# Altium project Mainboard.PrjPcb (part 2 of 3)

## Sheet Power_Switch.SchDoc
size A3; PageSetup: Record=PageOptions|CenterHorizontal=True|CenterVertical=True|PrintScale=0.71|XCorrection=1.00|YCorrection=1.00|PrintKind=0|BorderSize=5000000|LeftOffset=0|BottomOffset=0|Orientation=2|PaperLength=1000|PaperWidth=1000|Scale=100|PaperSource=7|PrintQuality=-4|MediaType=1|DitherType=10|PaperKind=A4|PrintScaleMode=1; Date: 27.05.2014; DrawnBy: luths8; Organization: BFH; Address1: Bern University of Applied Sciences; Address2: Engineering and Information Technology; Address3: Jlcoweg 1; Address4: CH-3400 Burgdorf; DocumentNumber: 4; Revision: 1.0; SheetNumber: 7; SheetTotal: 19; CurrentDate: 27.05.2014
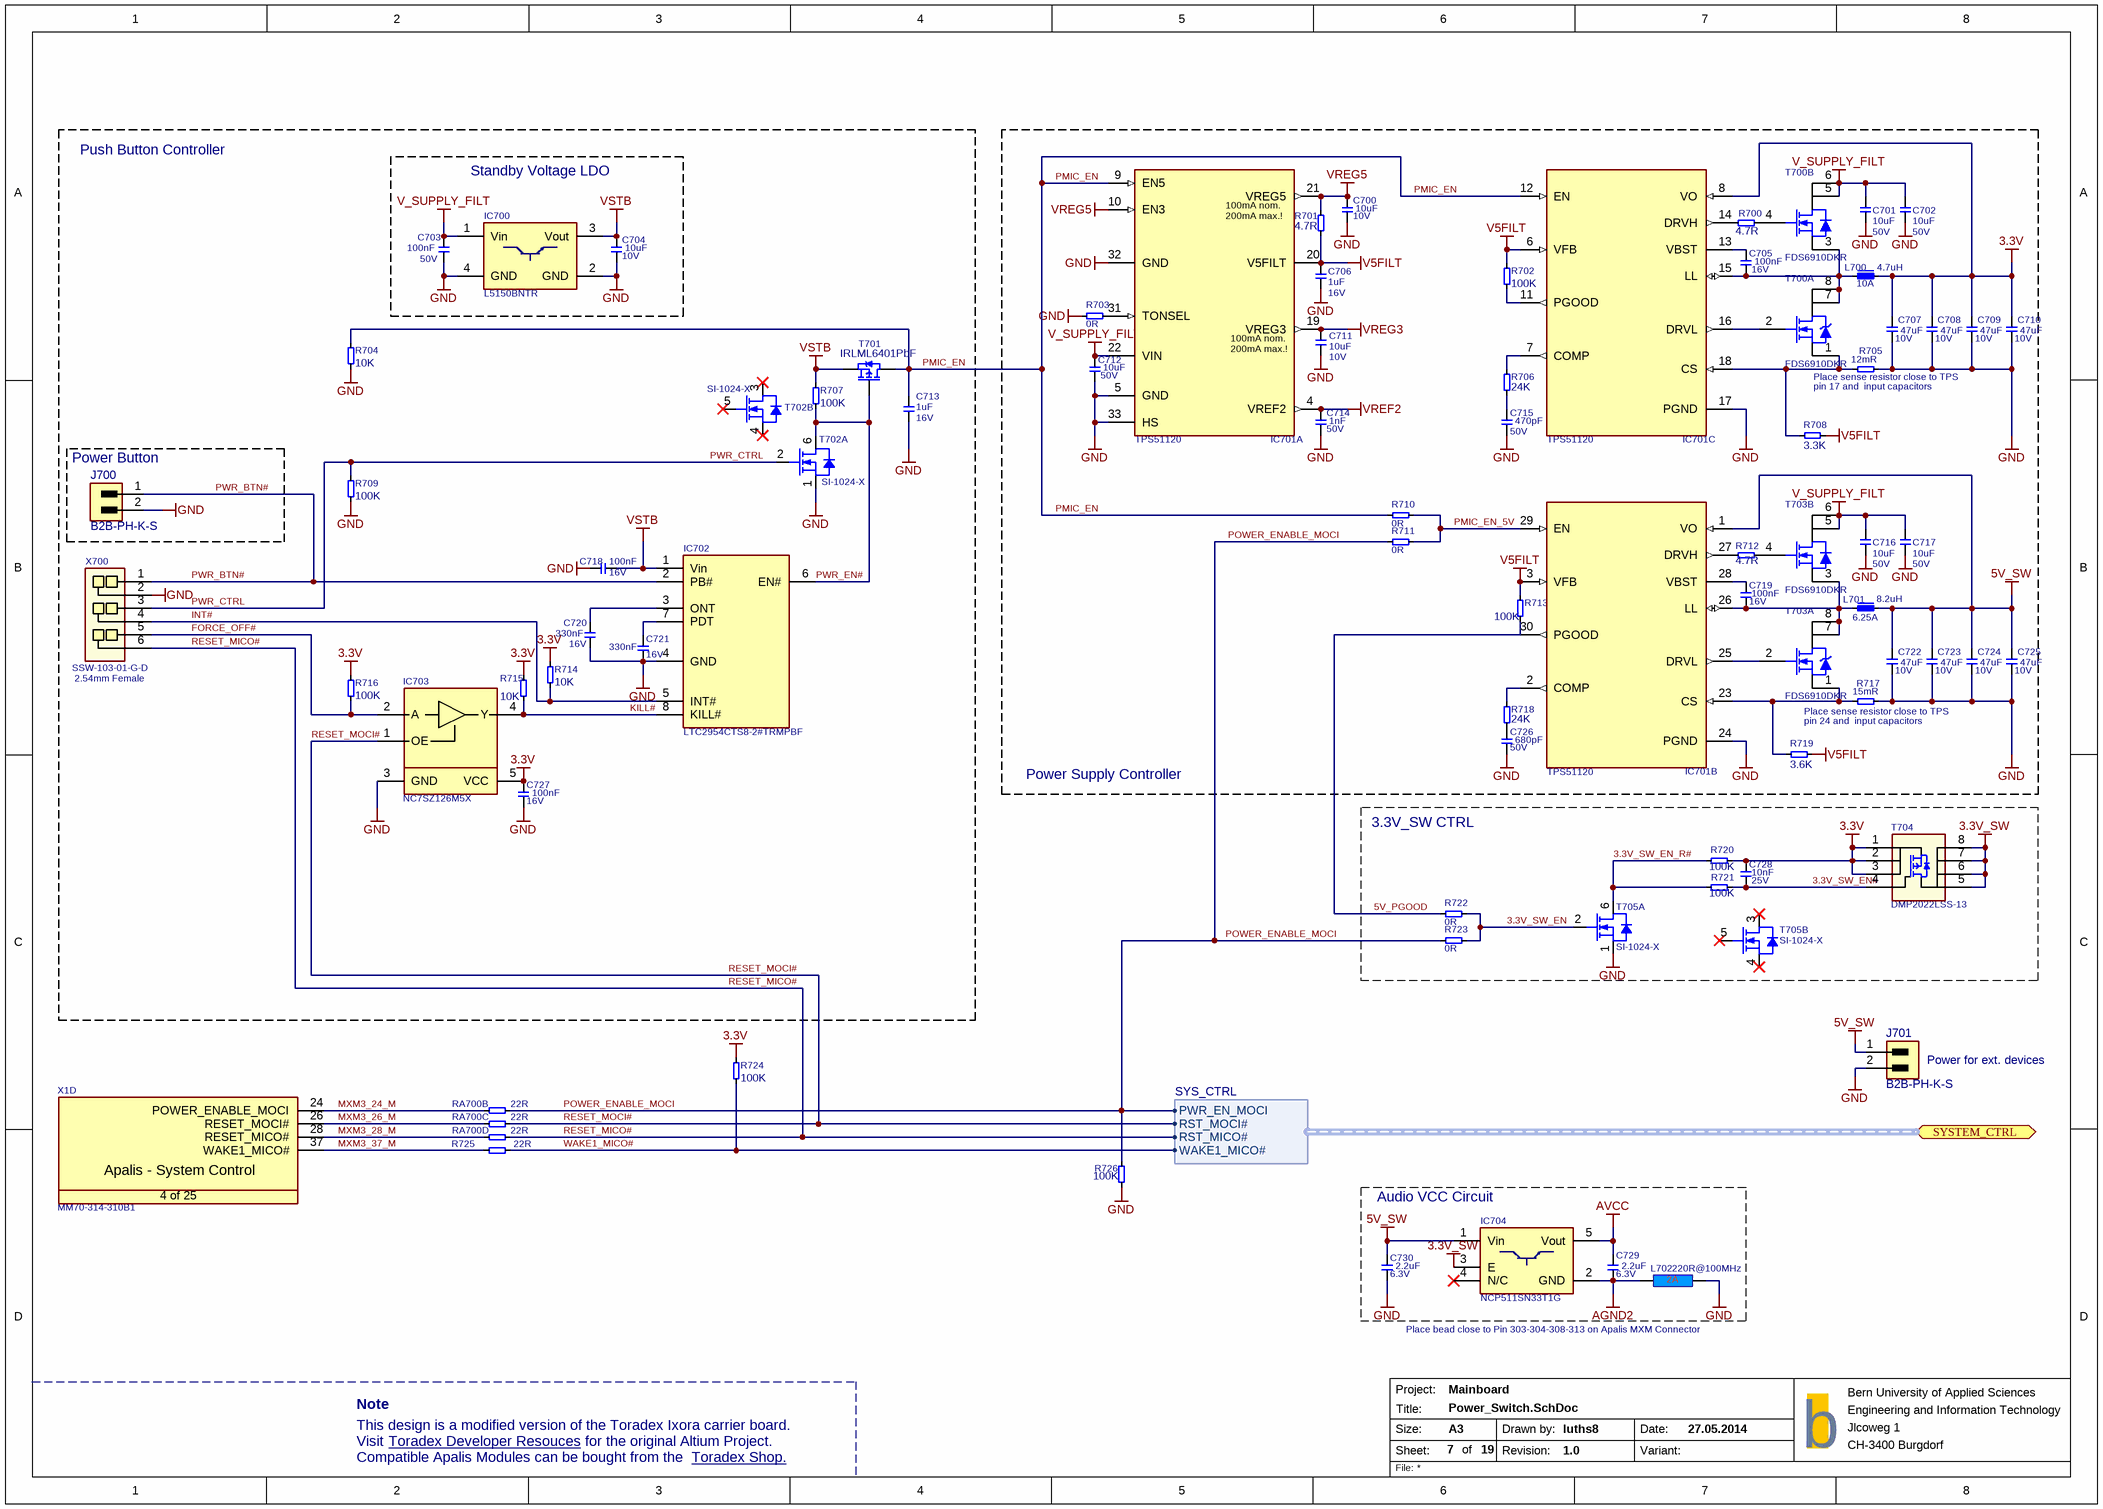
[diagram p8: Power_Switch.SchDoc]

### Parts
C700  Rating: 10V  [SMD0603CAP]  (hidden comment: 10uF)
C701  Rating: 50V  [SMD1210CAP]  (hidden comment: 10uF)
C702  Rating: 50V  [SMD1210CAP]  (hidden comment: 10uF)
C703  Rating: 50V  [SMD0603CAP]  (hidden comment: 100nF)
C704  Rating: 10V  [SMD0603CAP]  (hidden comment: 10uF)
C705  Rating: 16V  [SMD0603CAP]  (hidden comment: 100nF)
C706  Rating: 16V  [SMD0603CAP]  (hidden comment: 1uF)
C707  Rating: 10V  [SMD0805CAP]  (hidden comment: 47uF)
C708  Rating: 10V  [SMD0805CAP]  (hidden comment: 47uF)
C709  Rating: 10V  [SMD0805CAP]  (hidden comment: 47uF)
C710  Rating: 10V  [SMD0805CAP]  (hidden comment: 47uF)
C711  Rating: 10V  [SMD0603CAP]  (hidden comment: 10uF)
C712  Rating: 50V  [SMD1210CAP]  (hidden comment: 10uF)
C713  Rating: 16V  [SMD0603CAP]  (hidden comment: 1uF)
C714  Rating: 50V  [SMD0603CAP]  (hidden comment: 1nF)
C715  Rating: 50V  [SMD0603CAP]  (hidden comment: 470pF)
C716  Rating: 50V  [SMD1210CAP]  (hidden comment: 10uF)
C717  Rating: 50V  [SMD1210CAP]  (hidden comment: 10uF)
C718  Rating: 16V  [SMD0603CAP]  (hidden comment: 100nF)
C719  Rating: 16V  [SMD0603CAP]  (hidden comment: 100nF)
C720  Rating: 16V  [SMD0805CAP]  (hidden comment: 330nF)
C721  Rating: 16V  [SMD0805CAP]  (hidden comment: 330nF)
C722  Rating: 10V  [SMD0805CAP]  (hidden comment: 47uF)
C723  Rating: 10V  [SMD0805CAP]  (hidden comment: 47uF)
C724  Rating: 10V  [SMD0805CAP]  (hidden comment: 47uF)
C725  Rating: 10V  [SMD0805CAP]  (hidden comment: 47uF)
C726  Rating: 50V  [SMD0603CAP]  (hidden comment: 680pF)
C727  Rating: 16V  [SMD0603CAP]  (hidden comment: 100nF)
C728  Rating: 25V  [SMD0603CAP]  (hidden comment: 10nF)
C729  Rating: 6.3V  [SMD0603CAP]  (hidden comment: 2.2uF)
C730  Rating: 6.3V  [SMD0603CAP]  (hidden comment: 2.2uF)
IC700  L5150BNTR  [T_ON_NCV4264-2ST50T3G]
IC701  TPS51120  [QFN50P500X500X100-33N]  (parts A,B,C of 3)
IC702  LTC2954CTS8-2#TRMPBF  [T_LINEAR_LTC2954CTS8-2#PBF]
IC703  NC7SZ126M5X  [SOT95P279X142-5N]
IC704  NCP511SN33T1G  [SOT95P279X142-5N]
J700  B2B-PH-K-S  [B2B-PH-K-S]
J701  B2B-PH-K-S  [B2B-PH-K-S]
L700  Rating: 10A  [T_INDM110100]  (hidden comment: 4.7uH)
L701  Rating: 6.25A  [T_INDM120120X80N]  (hidden comment: 8.2uH)
L702  220R@100MHz  [INDC1608X95N]
R700  4.7R  [SMD0603RES]
R701  4.7R  [SMD0603RES]
R702  100K  [SMD0603RES]
R703  0R  [SMD0603RES]
R704  10K  [SMD0603RES]
R705  12mR  [SMD1206RES]
R706  24K  [SMD0603RES]
R707  100K  [SMD0603RES]
R708  3.3K  [SMD0603RES]
R709  100K  [SMD0603RES]
R710  0R  [SMD0603RES]
R711  0R  [SMD0603RES]
R712  4.7R  [SMD0603RES]
R713  100K  [SMD0603RES]
R714  10K  [SMD0603RES]
R715  10K  [SMD0603RES]
R716  100K  [SMD0603RES]
R717  15mR  [SMD1206RES]
R718  24K  [SMD0603RES]
R719  3.6K  [SMD0603RES]
R720  100K  [SMD0603RES]
R721  100K  [SMD0603RES]
R722  0R  [SMD0603RES]
R723  0R  [SMD0603RES]
R724  100K  [SMD0603RES]
R725  22R  [SMD0603RES]
R726  100K  [SMD0603RES]
RA700  22R  [T_Resistor_Array_X4]  (parts B,C,D of 4)
T700  FDS6910DKR  [SOIC127P600X173-8N]  (parts A,B of 2)
T701  IRLML6401PbF  [SOT95P237X112-3N]
T702  Manufacturer Part No.: SI-1024-X  [SOTFL50P160X60-6N]  (hidden comment: T-Vishay-SI-1024X-N)  (parts A,B of 2)
T703  FDS6910DKR  [SOIC127P600X173-8N]  (parts A,B of 2)
T704  DMP2022LSS-13  [SOIC127P600X173-8N]
T705  Manufacturer Part No.: SI-1024-X  [SOTFL50P160X60-6N]  (hidden comment: T-Vishay-SI-1024X-N)  (parts A,B of 2)
X1  Manufacturer Part No.: MM70-314-310B1  [T_JAE_MM70-314-310B1]  (hidden comment: CON-JAE-MM70-314-310B1-314-0.5mm)  (part D of 25)
X700  Manufacturer Part No.: SSW-103-01-G-D  [T_Samtec_SSW-103-01-G-D]  (hidden comment: TSW-103-01-G-D)

### Blocks framed on the sheet
Push Button Controller: C713 C718 C720 C721 C727 IC702 IC703 R704 R707 R709 R714-R716 T701 T702 X700
Standby Voltage LDO: C703 C704 IC700
Power Supply Controller: C700-C702 C705-C712 C714-C717 C719 C722-C726 IC701 L700 L701 R700-R703 R705 R706 R708 R710-R713 R717-R719 T700 T703
Power Button: J700
3.3V_SW CTRL: C728 R720-R723 T704 T705
Audio VCC Circuit: C729 C730 IC704 L702

### Ports
SYSTEM_CTRL (bidir, harness SYS_CTRL, see 12, 18, 19)

### Harnesses
SYS_CTRL: PWR_EN_MOCI, RST_MOCI#, RST_MICO#, WAKE1_MICO#

### Nets
3.3V: C707.2 C708.2 C709.2 C710.2 C727.1 C728.2 IC701.8(VO) IC703.5(VCC) L700.2 R714.1 R715.1 R716.2 R720.1 R724.2 T704.1(S) T704.2(S) T704.3(S)
3.3V_SW: IC704.3(E) T704.5(D) T704.6(D) T704.7(D) T704.8(D)
5V_SW: C722.2 C723.2 C724.2 C725.2 C730.2 IC701.1(VO) IC704.1(Vin) J701.1 L701.2
AGND2: C729.1 IC704.2(GND) L702.1
AVCC: C729.2 IC704.5(Vout)
GND: C700.1 C701.1 C702.1 C703.1 C704.1 C706.1 C707.1 C708.1 C709.1 C710.1 C711.1 C712.1 C713.1 C714.1 C715.1 C716.1 C717.1 C718.1 C720.1 C721.1 C722.1 C723.1 C724.1 C725.1 C726.1 C727.2 C730.1 IC700.2(GND) IC700.4(GND) IC701.5(GND) IC701.17(PGND) IC701.24(PGND) IC701.32(GND) IC701.33(HS) IC702.4(GND) IC703.3(GND) J700.2 J701.2 L702.2 R703.1 R704.1 R705.2 R709.1 R717.2 R726.1 T702.1(S) T705.1(S) X700.2
V5FILT: C706.2 IC701.3(VFB) IC701.6(VFB) IC701.20(V5FILT) R701.1 R702.2 R708.2 R713.2 R719.2
V_SUPPLY_FILT: C701.2 C702.2 C703.2 C712.2 C716.2 C717.2 IC700.1(Vin) IC701.22(VIN) T700.5(D) T700.6(D) T703.5(D) T703.6(D)
VREF2: C714.2 IC701.4(VREF2)
VREG3: C711.2 IC701.19(VREG3)
VREG5: C700.2 IC701.10(EN3) IC701.21(VREG5) R701.2
VSTB: C704.2 C718.2 IC700.3(Vout) IC702.1(Vin) R707.2 T701.2
3.3V_SW_EN: R722.1 R723.2 T705.2(G)
3.3V_SW_EN#: C728.1 R721.1 T704.4(G)
3.3V_SW_EN_R#: R720.2 R721.2 T705.6(D)
5V_PGOOD: IC701.30(PGOOD) R713.1 R722.2
FORCE_OFF#: IC703.2(A) R716.1 X700.5
INT#: IC702.5(INT#) R714.2 X700.4
KILL#: IC702.8(KILL#) IC703.4(Y) R715.2
MXM3_24_M: RA700.2 X1.24(POWER_ENABLE_MOCI)
MXM3_26_M: RA700.3 X1.26(RESET_MOCI#)
MXM3_28_M: RA700.4 X1.28(RESET_MICO#)
MXM3_37_M: R725.1 X1.37(WAKE1_MICO#)
PMIC_EN: C713.2 IC701.9(EN5) IC701.12(EN) R704.2 R710.1 T701.3
PMIC_EN_5V: IC701.29(EN) R710.2 R711.2
POWER_ENABLE_MOCI: R711.1 R723.1 R726.2 RA700.6 ; port SYSTEM_CTRL.PWR_EN_MOCI
PWR_BTN#: IC702.2(PB#) J700.1 X700.1
PWR_CTRL: R709.2 T702.2(G) X700.3
PWR_EN#: IC702.6(EN#) R707.1 T701.1 T702.6(D)
RESET_MICO#: RA700.8 X700.6 ; port SYSTEM_CTRL.RST_MICO#
RESET_MOCI#: IC703.1(OE) RA700.7 ; port SYSTEM_CTRL.RST_MOCI#
WAKE1_MICO#: R724.1 R725.2 ; port SYSTEM_CTRL.WAKE1_MICO#
NetC705_1: C705.1 IC701.15(LL) L700.1 T700.3(S) T700.7(D) T700.8(D)
NetC705_2: C705.2 IC701.13(VBST)
NetC715_2: C715.2 R706.1
NetC719_1: C719.1 IC701.26(LL) L701.1 T703.3(S) T703.7(D) T703.8(D)
NetC719_2: C719.2 IC701.28(VBST)
NetC720_2: C720.2 IC702.3(ONT)
NetC721_2: C721.2 IC702.7(PDT)
NetC726_2: C726.2 R718.1
NetIC701_2: IC701.2(COMP) R718.2
NetIC701_7: IC701.7(COMP) R706.2
NetIC701_11: IC701.11(PGOOD) R702.1
NetIC701_14: IC701.14(DRVH) R700.1
NetIC701_16: IC701.16(DRVL) T700.2(G)
NetIC701_18: IC701.18(CS) R705.1 R708.1 T700.1(S)
NetIC701_23: IC701.23(CS) R717.1 R719.1 T703.1(S)
NetIC701_25: IC701.25(DRVL) T703.2(G)
NetIC701_27: IC701.27(DRVH) R712.1
NetIC701_31: IC701.31(TONSEL) R703.2
NetR700_2: R700.2 T700.4(G)
NetR712_2: R712.2 T703.4(G)

Not connected (* = marked no-connect by the designer): IC704 4(N/C)*; T702 3(D)* 4(S)* 5(G)*; T705 3(D)* 4(S)* 5(G)*

### Notes on the sheet
- (near R705) Place sense resistor close to TPS
- (near R705) pin 17 and  input capacitors
- (near X700) 2.54mm Female
- (near R717) Place sense resistor close to TPS
- pin 24 and  input capacitors
- (near J701) Power for ext. devices
- Place bead close to Pin 303-304-308-313 on Apalis MXM Connector
- Note
- This design is a modified version of the Toradex Ixora carrier board.
- Visit
- Compatible Apalis Modules can be bought from the
- Toradex Developer Resouces <https://developer.toradex.com/products/ixora-carrier-board>
- for the original Altium Project.
- Toradex Shop. <https://www.toradex.com/order-now/apalis-arm-family>
- Project:
- Size:
- Sheet:
- Title:
- A3
- of
- Drawn by:
- Revision:
- Date:
- Variant:
- b
- File:
- (in symbol CON-JAE-MM70-314-310B1-314-0.5mm, part D) Apalis - System Control; 4 of 25
- (in symbol IC-TI-TPS51120, part A) 100mA nom.; 200mA max.!

### Library data of the parts
C700 C704 C711 = C-X5R-10uF-10V-20%-0603: Capacitor Ceramic X5R 10uF 10V 20% 0603; Tolerance: 20%; Type: X5R; Value: 10uF
C701 C702 C712 C716 C717 = C-X5R-10uF-50V-20%-1210: Capacitor Ceramic X5R 10uF 50V 20% 1210; Tolerance: 20%; Type: X5R; Value: 10uF
C703 = C-X7R-100nF-50V-20%-0603: Capacitor Ceramic X7R 100nF 50V 20% 0603; Tolerance: 20%; Type: X7R; Value: 100nF
C705 C718 C719 C727 = C-X7R-100nF-16V-10%-0402: Capacitor Ceramic X7R 100nF 16V 10% 0603; Tolerance: 10%; Type: X7R; Value: 100nF
C706 C713 = C-X5R-1uF-16V-20%-0603: Capacitor Ceramic X5R 1uF 16V 20% 0603; Tolerance: 20%; Type: X5R; Value: 1uF
C707-C710 C722-C725 = C-X5R-47uF-10V-20%-0805: Capacitor Ceramic X5R 47uF 10V 20% 0805; Tolerance: 20%; Type: X5R; Value: 47uF
C714 = C-X7R-1nF-50V-10%-0402: Capacitor Ceramic X7R 1nF 50V 10% 0603; Tolerance: 10%; Type: X7R; Value: 1nF
C715 = C-X7R-470pF-50V-10%-0402: Capacitor Ceramic X7R 470pF 50V 10% 0603; Tolerance: 10%; Type: X7R; Value: 470pF
C720 C721 = C-X7R-330nF-16V-10%-0805: Capacitor Ceramic X7R 330nF 16V 10% 0805; Tolerance: 10%; Type: X7R; Value: 330nF
C726 = C-X7R-680pF-50V-10%-0402: Capacitor Ceramic X7R 680pF 50V 10% 0603; Tolerance: 10%; Type: X7R; Value: 680pF
C728 = C-X7R-10nF-25V-10%-0402: Capacitor Ceramic X7R 10nF 25V 10% 0603; Tolerance: 10%; Type: X7R; Value: 10nF
C729 C730 = C-X5R-2.2uF-6.3V-20%-0603: Capacitor Ceramic X5R 2.2uF 6.3V 20% 0603; Tolerance: 20%; Type: X5R; Value: 2.2uF
IC700 = IC-ON-NCV4264-2ST50T3G: L5150BNTR LDO Regulator; Manufacturer Name: STMicroelectronics; Manufacturer Part No.: L5150BNTR
IC701 = IC-TI-TPS51120: Power Supply Controller; Manufacturer Name: Texas Instruments; Manufacturer Part No.: TPS51120
IC702 = IC-LIN-LTC2954CTS8-2#PBF: Push Button On/Off Controller; Manufacturer Name: Linear; Manufacturer Part No.: LTC2954CTS8-2#TRMPBF
IC703 = IC-FAR-NC7SZ126M5X: NC7SZ126M5X  Buffer Three-State Output; Manufacturer Name: Fairchild Semiconductor; Manufacturer Part No.: NC7SZ126M5X
IC704 = IC-ON-NCP511SN33T1G: NCP511SN33T1G LDO Regulator; Manufacturer Name: ON Semiconductor; Manufacturer Part No.: NCP511SN33T1G
J700 J701 = Connector 2x1P: Manufacturer Part No.: B2B-PH-K-S
L700 = L-Bourns-SRP1038A-4R7M: Inductor 4.7uH 10A 20% 15.5 mOhm -40°C to125°C; Manufacturer Name: Bourns; Tolerance: 20%; Manufacturer Part No.: SRP1038A-4R7M; Value: 4.7uH; DC Resistance: 15.5 mOhm
L701 = L-Wurth-744771008-8.2uH-6.25A-20%: Inductance 8.2uH 6.25A 20%; Manufacturer Name: Wurth; Tolerance: 20%; Manufacturer Part No.: 744771008; Value: 8.2uH
L702 = L-220R@100MHz-2A-25%-0603: 220R@100MHz 2A EMI FILTER; Tolerance: 25%; Rating: 2A; Value: 220R@100MHz
R700 R701 R712 = R-4.7R-63mW-5%-0402: Resistor 4.7 ohm 63mW 5% 0603; Rating: 63mW; Tolerance: 5%; Value: 4.7R
R702 R707 R709 R713 R716 R720 R721 R724 R726 = R-100KR-63mW-5%-0402: Resistor 100 Kohm 63mW 5% 0603; Value: 100KR; Rating: 63mW; Tolerance: 5%
R703 = R-0R-63mW-1%-0402: Resistor 0 ohm 63mW 1% 0603; Rating: 63mW; Tolerance: 1%; Value: 0R
R704 R714 R715 = R-10KR-63mW-5%-0402: Resistor 10 Kohm 63mW 5% 0603; Value: 10KR; Rating: 63mW; Tolerance: 5%
R705 = R-12mR-250mW-1%-1206: Resistor 12 mohm 250mW 1% 1206; Rating: 250mW; Tolerance: 1%; Value: 12mR
R706 R718 = R-24KR-63mW-1%-0402: Resistor 24 Kohm 63mW 1% 0603; Value: 24KR; Rating: 63mW; Tolerance: 1%
R708 = R-3.3KR-63mW-1%-0402: Resistor 3.3 Kohm 63mW 1% 0603; Value: 3.3KR; Rating: 63mW; Tolerance: 1%
R710 R711 R722 R723 = R-0R-63mW-1%-0603: Resistor 0 ohm 63mW 1% 0603; Rating: 63mW; Tolerance: 1%; Value: 0R
R717 = R-15mR-250mW-1%-1206: Resistor 15 mohm 250mW 1% 1206; Rating: 250mW; Tolerance: 1%; Value: 15mR
R719 = R-3.6KR-63mW-1%-0402: Resistor 3.6 Kohm 63mW 1% 0603; Value: 3.6KR; Rating: 63mW; Tolerance: 1%
R725 = R-22R-63mW-5%-0402: Resistor 22 ohm 63mW 5% 0603; Rating: 63mW; Tolerance: 5%; Value: 22R
RA700 = RA-22R-63mW-5%-1206-div: Resistor Array 22 R 63mW 5% 1206; Tolerance: 5%; Power Dissipation: 63mW; Value: 22R
T700 T703 = T-Fairchild-FDS6982AS-N: N-Channel PowerTrench SyncFET; Manufacturer Name: Fairchild; Manufacturer Part No.: FDS6910DKR
T701 = T-IR-IRLML6401PbF-SOT-23: p-channel MOSFET, IRLML6401PbF; Manufacturer Name: International Rectifier; Manufacturer Part No.: IRLML6401PbF
T702 T705 = T-Vishay-SI-1024X-N: Dual N-Channel 20V (D-S)  MOSFET; Manufacturer Name: Vishay
T704 = T-Diodes-DMP2022LSS-13-8-SOIC: p-channel MOSFET, DMP2022LSS-13; Manufacturer Name: DIODES; Manufacturer Part No.: DMP2022LSS-13
X1 = CON-JAE-MM70-314-310B1-314-0.5mm: MXM3 Connector; Manufacturer Name: JAE; No. of ways: 314
X700 = CON-Samtec-SSW-103-01-G-D: Receptacle Female Socket, 2x3 Pins, 2.54mm pitch; Manufacturer Name: Samtec; No. of ways: 2x3; Pitch: 2.54mm

## Sheet RGB_Display.SchDoc
size A3; PageSetup: Record=PageOptions|CenterHorizontal=True|CenterVertical=True|PrintScale=0.73|XCorrection=1.00|YCorrection=1.00|PrintKind=0|BorderSize=5000000|LeftOffset=0|BottomOffset=0|Orientation=2|PaperLength=1000|PaperWidth=1000|Scale=100|PaperSource=7|PrintQuality=-4|MediaType=1|DitherType=10|PaperKind=A4|PrintScaleMode=1; Date: 27.05.2014; DrawnBy: luths8; Organization: BFH; Address1: Bern University of Applied Sciences; Address2: Engineering and Information Technology; Address3: Jlcoweg 1; Address4: CH-3400 Burgdorf; DocumentNumber: 9; Revision: 1.0; SheetNumber: 13; SheetTotal: 19; CurrentDate: 27.05.2014
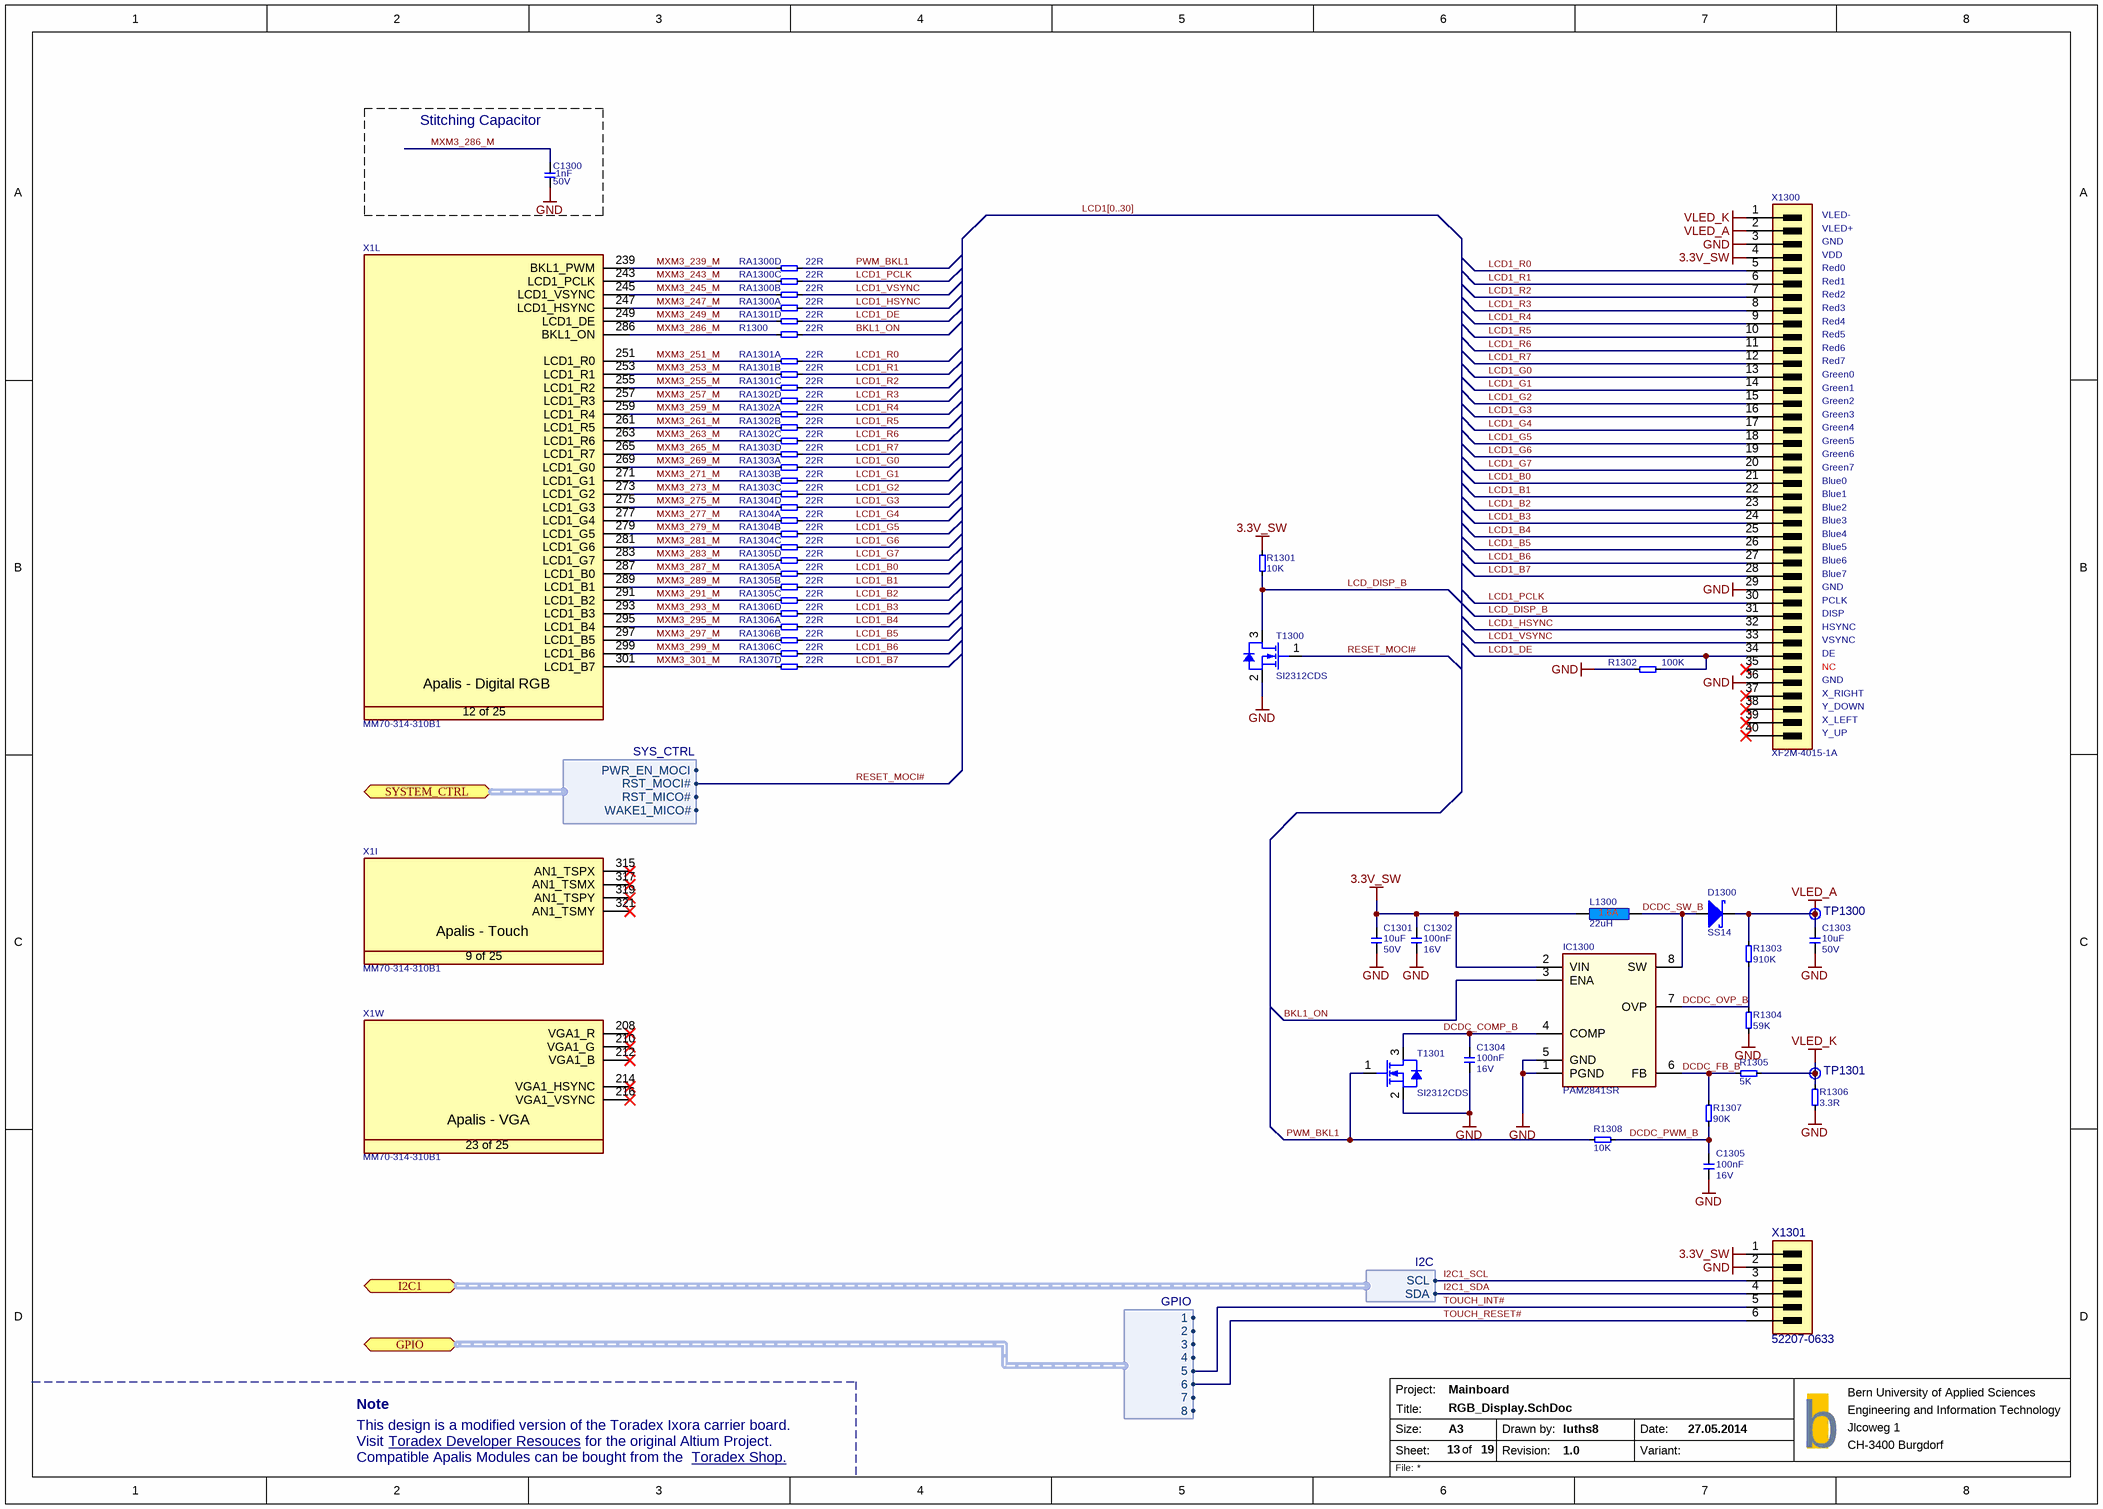
[diagram p9: RGB_Display.SchDoc]

### Parts
C1300  Rating: 50V  [SMD0603CAP]  (hidden comment: 1nF)
C1301  Rating: 50V  [SMD1210CAP]  (hidden comment: 10uF)
C1302  Rating: 16V  [SMD0603CAP]  (hidden comment: 100nF)
C1303  Rating: 50V  [SMD1210CAP]  (hidden comment: 10uF)
C1304  value 100nF  Rating: 16V  [SMD0603CAP]  (hidden comment: 100nF 16V)
C1305  value 100nF  Rating: 16V  [SMD0603CAP]  (hidden comment: 100nF 16V)
D1300  SS14  [T_DO-214-AC]
IC1300  PAM2841SR  [T_TSOP65P490X110-8N]
L1300  22uH  [T_INDM5050]
R1300  22R  [SMD0603RES]
R1301  10K  [SMD0603RES]
R1302  100K  [SMD0603RES]
R1303  910K  [SMD0603RES]
R1304  59K  [SMD0603RES]
R1305  5K  [SMD0603RES]
R1306  3.3R  [SMD0603RES]
R1307  90K  [SMD0603RES]
R1308  10K  [SMD0603RES]
RA1300  22R  [T_Resistor_Array_X4]  (parts A,B,C,D of 4)
RA1301  22R  [T_Resistor_Array_X4]  (parts A,B,C,D of 4)
RA1302  22R  [T_Resistor_Array_X4]  (parts A,B,C,D of 4)
RA1303  22R  [T_Resistor_Array_X4]  (parts A,B,C,D of 4)
RA1304  22R  [T_Resistor_Array_X4]  (parts A,B,C,D of 4)
RA1305  22R  [T_Resistor_Array_X4]  (parts A,B,C,D of 4)
RA1306  22R  [T_Resistor_Array_X4]  (parts A,B,C,D of 4)
RA1307  22R  [T_Resistor_Array_X4]  (part D of 4)
T1300  SI2312CDS  [T_SOT95P230X110-3N]
T1301  SI2312CDS  [T_SOT95P230X110-3N]
TP1300  Testpoint  [TP]  (value not drawn)  (no BOM)
TP1301  Testpoint  [TP]  (value not drawn)  (no BOM)
X1  Manufacturer Part No.: MM70-314-310B1  [T_JAE_MM70-314-310B1]  (hidden comment: CON-JAE-MM70-314-310B1-314-0.5mm)  (parts I,L,W of 25)
X1300  XF2M-4015-1A  [T_Omron_XF2M-4015-1A-MIRROR]
X1301  52207-0633  [T_MOLEX_52207-0633]

### Blocks framed on the sheet
Stitching Capacitor: C1300

### Ports
GPIO (bidir, harness GPIO, see 11, 19, 4), I2C1 (bidir, harness I2C, see 17, 18, 19, 5), SYSTEM_CTRL (bidir, harness SYS_CTRL, see 18, 19, 4)

### Harnesses
I2C: SCL, SDA
SYS_CTRL: PWR_EN_MOCI, RST_MOCI#, RST_MICO#, WAKE1_MICO#
GPIO: 1, 2, 3, 4, 5, 6, 7, 8

### Nets
3.3V_SW: C1301.2 C1302.1 IC1300.2(VIN) L1300.1 R1301.2 X1300.4(VCC) X1301.1
GND: C1300.1 C1301.1 C1302.2 C1303.1 C1304.1 C1305.1 IC1300.1(PGND) IC1300.5(GND) R1302.1 R1304.1 R1306.1 T1300.2(S) T1301.2(S) X1300.3(VCC) X1300.29(VSS) X1300.36(VDD) X1301.2
VLED_A: C1303.2 D1300.1 R1303.2 TP1300.1 X1300.2(VSS)
VLED_K: R1305.2 R1306.2 TP1301.1 X1300.1(VSS)
BKL1_ON: IC1300.3(ENA) R1300.2
DCDC_COMP_B: C1304.2 IC1300.4(COMP) T1301.3(D)
DCDC_FB_B: IC1300.6(FB) R1305.1 R1307.2
DCDC_OVP_B: IC1300.7(OVP) R1303.1 R1304.2
DCDC_PWM_B: C1305.2 R1307.1 R1308.2
DCDC_SW_B: D1300.2 IC1300.8(SW) L1300.2
I2C1_SCL: X1301.3 ; port I2C1.SCL
I2C1_SDA: X1301.4 ; port I2C1.SDA
LCD1_B0: RA1305.7 X1300.21(VSS)
LCD1_B1: RA1305.6 X1300.22(R5)
LCD1_B2: RA1305.5 X1300.23(R4)
LCD1_B3: RA1306.8 X1300.24(R3)
LCD1_B4: RA1306.7 X1300.25(R2)
LCD1_B5: RA1306.6 X1300.26(R1)
LCD1_B6: RA1306.5 X1300.27(R0)
LCD1_B7: RA1307.8 X1300.28(DCLK)
LCD1_DE: R1302.2 RA1301.8 X1300.34(SHUT)
LCD1_G0: RA1303.7 X1300.13(B0)
LCD1_G1: RA1303.6 X1300.14(VSS)
LCD1_G2: RA1303.5 X1300.15(G5)
LCD1_G3: RA1304.8 X1300.16(G4)
LCD1_G4: RA1304.7 X1300.17(G3)
LCD1_G5: RA1304.6 X1300.18(G2)
LCD1_G6: RA1304.5 X1300.19(G1)
LCD1_G7: RA1305.8 X1300.20(G0)
LCD1_HSYNC: RA1300.5 X1300.32(ENB)
LCD1_PCLK: RA1300.7 X1300.30(HSYNC)
LCD1_R0: RA1301.7 X1300.5(PWCTRL)
LCD1_R1: RA1301.6 X1300.6(LEDCTRL)
LCD1_R2: RA1301.5 X1300.7(RESET#)
LCD1_R3: RA1302.8 X1300.8(B5)
LCD1_R4: RA1302.7 X1300.9(B4)
LCD1_R5: RA1302.6 X1300.10(B3)
LCD1_R6: RA1302.5 X1300.11(B2)
LCD1_R7: RA1303.8 X1300.12(B1)
LCD1_VSYNC: RA1300.6 X1300.33(NC)
LCD_DISP_B: R1301.1 T1300.3(D) X1300.31(VSYNC)
MXM3_239_M: RA1300.4 X1.239(BKL1_PWM)
MXM3_243_M: RA1300.3 X1.243(LCD1_PCLK)
MXM3_245_M: RA1300.2 X1.245(LCD1_VSYNC)
MXM3_247_M: RA1300.1 X1.247(LCD1_HSYNC)
MXM3_249_M: RA1301.4 X1.249(LCD1_DE)
MXM3_251_M: RA1301.3 X1.251(LCD1_R0)
MXM3_253_M: RA1301.2 X1.253(LCD1_R1)
MXM3_255_M: RA1301.1 X1.255(LCD1_R2)
MXM3_257_M: RA1302.4 X1.257(LCD1_R3)
MXM3_259_M: RA1302.3 X1.259(LCD1_R4)
MXM3_261_M: RA1302.2 X1.261(LCD1_R5)
MXM3_263_M: RA1302.1 X1.263(LCD1_R6)
MXM3_265_M: RA1303.4 X1.265(LCD1_R7)
MXM3_269_M: RA1303.3 X1.269(LCD1_G0)
MXM3_271_M: RA1303.2 X1.271(LCD1_G1)
MXM3_273_M: RA1303.1 X1.273(LCD1_G2)
MXM3_275_M: RA1304.4 X1.275(LCD1_G3)
MXM3_277_M: RA1304.3 X1.277(LCD1_G4)
MXM3_279_M: RA1304.2 X1.279(LCD1_G5)
MXM3_281_M: RA1304.1 X1.281(LCD1_G6)
MXM3_283_M: RA1305.4 X1.283(LCD1_G7)
MXM3_286_M: C1300.2 R1300.1 X1.286(BKL1_ON)
MXM3_287_M: RA1305.3 X1.287(LCD1_B0)
MXM3_289_M: RA1305.2 X1.289(LCD1_B1)
MXM3_291_M: RA1305.1 X1.291(LCD1_B2)
MXM3_293_M: RA1306.4 X1.293(LCD1_B3)
MXM3_295_M: RA1306.3 X1.295(LCD1_B4)
MXM3_297_M: RA1306.2 X1.297(LCD1_B5)
MXM3_299_M: RA1306.1 X1.299(LCD1_B6)
MXM3_301_M: RA1307.4 X1.301(LCD1_B7)
PWM_BKL1: R1308.1 RA1300.8 T1301.1(G)
RESET_MOCI#: T1300.1(G) ; port SYSTEM_CTRL.RST_MOCI#
TOUCH_INT#: X1301.5 ; port GPIO.5
TOUCH_RESET#: X1301.6 ; port GPIO.6

Not connected (* = marked no-connect by the designer): X1 208(VGA1_R)* 210(VGA1_G)* 212(VGA1_B)* 214(VGA1_HSYNC)* 216(VGA1_VSYNC)* 315(AN1_TSPX)* 317(AN1_TSMX)* 319(AN1_TSPY)* 321(AN1_TSMY)*; X1300 35(VSS)* 37(YU)* 38(XR)* 39(YD)* 40(XL)*

### Buses and harness runs
bus LCD1[0..30]

### Notes on the sheet
- (near X1300) VLED-
- (near X1300) VLED+
- (near X1300) GND
- (near X1300) Red0
- (near X1300) Red1
- (near X1300) Red2
- (near X1300) Red3
- (near X1300) VDD
- (near X1300) Green0
- (near X1300) Red4
- (near X1300) Red5
- (near X1300) Red6
- (near X1300) Red7
- (near X1300) Green1
- (near X1300) Green2
- (near X1300) Green3
- (near X1300) Green4
- (near X1300) Green5
- (near X1300) Blue0
- (near X1300) Blue1
- (near X1300) Blue2
- (near X1300) Green6
- (near X1300) Green7
- (near X1300) Blue3
- (near X1300) Blue4
- (near X1300) Blue5
- (near X1300) Blue6
- (near X1300) Blue7
- (near X1300) PCLK
- (near X1300) DISP
- (near X1300) HSYNC
- (near X1300) VSYNC
- (near X1300) DE
- (near X1300) NC
- (near X1300) X_RIGHT
- (near X1300) Y_DOWN
- (near X1300) X_LEFT
- (near X1300) Y_UP
- Note
- This design is a modified version of the Toradex Ixora carrier board.
- Visit
- Compatible Apalis Modules can be bought from the
- Toradex Developer Resouces <https://developer.toradex.com/products/ixora-carrier-board>
- for the original Altium Project.
- Toradex Shop. <https://www.toradex.com/order-now/apalis-arm-family>
- Project:
- Size:
- Sheet:
- Title:
- A3
- of
- Drawn by:
- Revision:
- Date:
- Variant:
- b
- File:
- (in symbol CON-JAE-MM70-314-310B1-314-0.5mm, part I) Apalis - Touch; 9 of 25
- (in symbol CON-JAE-MM70-314-310B1-314-0.5mm, part L) Apalis - Digital RGB; 12 of 25
- (in symbol CON-JAE-MM70-314-310B1-314-0.5mm, part W) Apalis - VGA; 23 of 25

### Library data of the parts
C1300 = C-X7R-1nF-50V-10%-0402: Capacitor Ceramic X7R 1nF 50V 10% 0603; Tolerance: 10%; Type: X7R; Value: 1nF
C1301 C1303 = C-X5R-10uF-50V-10%-1210: Capacitor Ceramic X5R 10uF 50V 10% 1210; Manufacturer: Generic; Tolerance: 10%; Type: X5R; Manufacturer Part Number: *; Value: 10uF
C1302 = C-X7R-100nF-16V-10%-0603: Capacitor Ceramic X7R 100nF 16V 10% 0603; Manufacturer: Generic; Tolerance: 10%; Type: X7R; Manufacturer Part Number: *; Value: 100nF
C1304 C1305 = C-X7R-100nF-16V-10%-0603: Capacitor Ceramic X7R 100nF 16V 10% 0603; Tolerance: 10%; Type: X7R
D1300 = D-Fairchild-SS14: Schottky Diode 40V 1A; Manufacturer Name: Fairdhild; Manufacturer Part No.: SS14
IC1300 = IC-DiodesInc-PAM2841GR: Diodes Inc, PAM2841GR, DC/DC step-up LED driver; Manufacturer: Diodes Incorporated; Manufacturer Part No.: PAM2841GR; Package: DFN2x2-8
L1300 = L-Bourns-SRN5040-220M: Inductor shielded 22uH 1.6A; Manufacturer: Generic; Tolerance: 25%; Rating: 1.6A; Manufacturer Part Number: *; Value: 22uH
R1300 = R-22R-63mW-5%-0402: Resistor 22 ohm 63mW 5% 0603; Rating: 63mW; Tolerance: 5%; Value: 22R
R1301 R1308 = R-10KR-63mW-1%-0603: Resistor 10 Kohm 63mW 1% 0603; Manufacturer: Generic; Rating: 63mW; Tolerance: 1%; Value: 10K; Manufacturer Part Number: *
R1302 = R-100KR-63mW-5%-0603: Resistor 100 Kohm 63mW 5% 0603; Manufacturer: Generic; Value: 100KR; Rating: 63mW; Tolerance: 5%; Manufacturer Part Number: *
R1303 = R-910KR-63mW-1%-0603: Resistor 910 Kohm 63mW 1% 0603; Manufacturer: Generic; Value: 910KR; Rating: 63mW; Tolerance: 1%; Manufacturer Part Number: *
R1304 = R-59KR-63mW-1%-0603: Resistor 59 Kohm 63mW 1% 0603; Manufacturer: Generic; Value: 49KR; Rating: 63mW; Tolerance: 1%; Manufacturer Part Number: *
R1305 = R-5KR-63mW-1%-0603: Resistor 5 Kohm 63mW 1% 0603; Manufacturer: Generic; Rating: 63mW; Tolerance: 1%; Value: 5K; Manufacturer Part Number: *
R1306 = R-3.3R-63mW-1%-0603: Resistor 3.3 ohm 63mW 1% 0603; Manufacturer: Generic; Rating: 63mW; Tolerance: 1%; Manufacturer Part Number: *; Value: 3.3R
R1307 = R-90KR-63mW-1%-0603: Resistor 90 Kohm 63mW 1% 0603; Manufacturer: Generic; Rating: 63mW; Tolerance: 1%; Value: 90K; Manufacturer Part Number: *
RA1300-RA1307 = RA-22R-63mW-5%-1206-div: Resistor Array 22 R 63mW 5% 1206; Tolerance: 5%; Power Dissipation: 63mW; Value: 22R
T1300 T1301 = T-Vishay-SI2312CDS: N-Channel 20V (D-S)  MOSFET; Manufacturer: Vishay; Manufacturer Part No.: SI2312CDS
X1 = CON-JAE-MM70-314-310B1-314-0.5mm: as X1 on sheet Power_Switch
X1300 = CON-Omron-XF2M-4015-1A-40-0.5mm: RGB Connector; Manufacturer Name: Omron; No. of ways: 40; Pitch: 0.5mm; Manufacturer Part No.: XF2M-4015-1A; System: Connector
X1301 = CON-Molex-52207-0633: 1mm Pitch FFC/FPC Connector; Manufacturer Name: Molex; No. of ways: 8; Pitch: 0.5mm; Manufacturer Part No.: 52207-0633; System: Connector

## Sheet RTC.SchDoc
size A3; PageSetup: Record=PageOptions|CenterHorizontal=True|CenterVertical=True|PrintScale=0.73|XCorrection=1.00|YCorrection=1.00|PrintKind=0|BorderSize=5000000|LeftOffset=0|BottomOffset=0|Orientation=2|PaperLength=1000|PaperWidth=1000|Scale=100|PaperSource=7|PrintQuality=-4|MediaType=1|DitherType=10|PaperKind=A4|PrintScaleMode=1; Date: 27.05.2014; DrawnBy: luths8; Organization: BFH; Address1: Bern University of Applied Sciences; Address2: Engineering and Information Technology; Address3: Jlcoweg 1; Address4: CH-3400 Burgdorf; DocumentNumber: 5; Revision: 1.0; SheetNumber: 8; SheetTotal: 19; CurrentDate: 27.05.2014
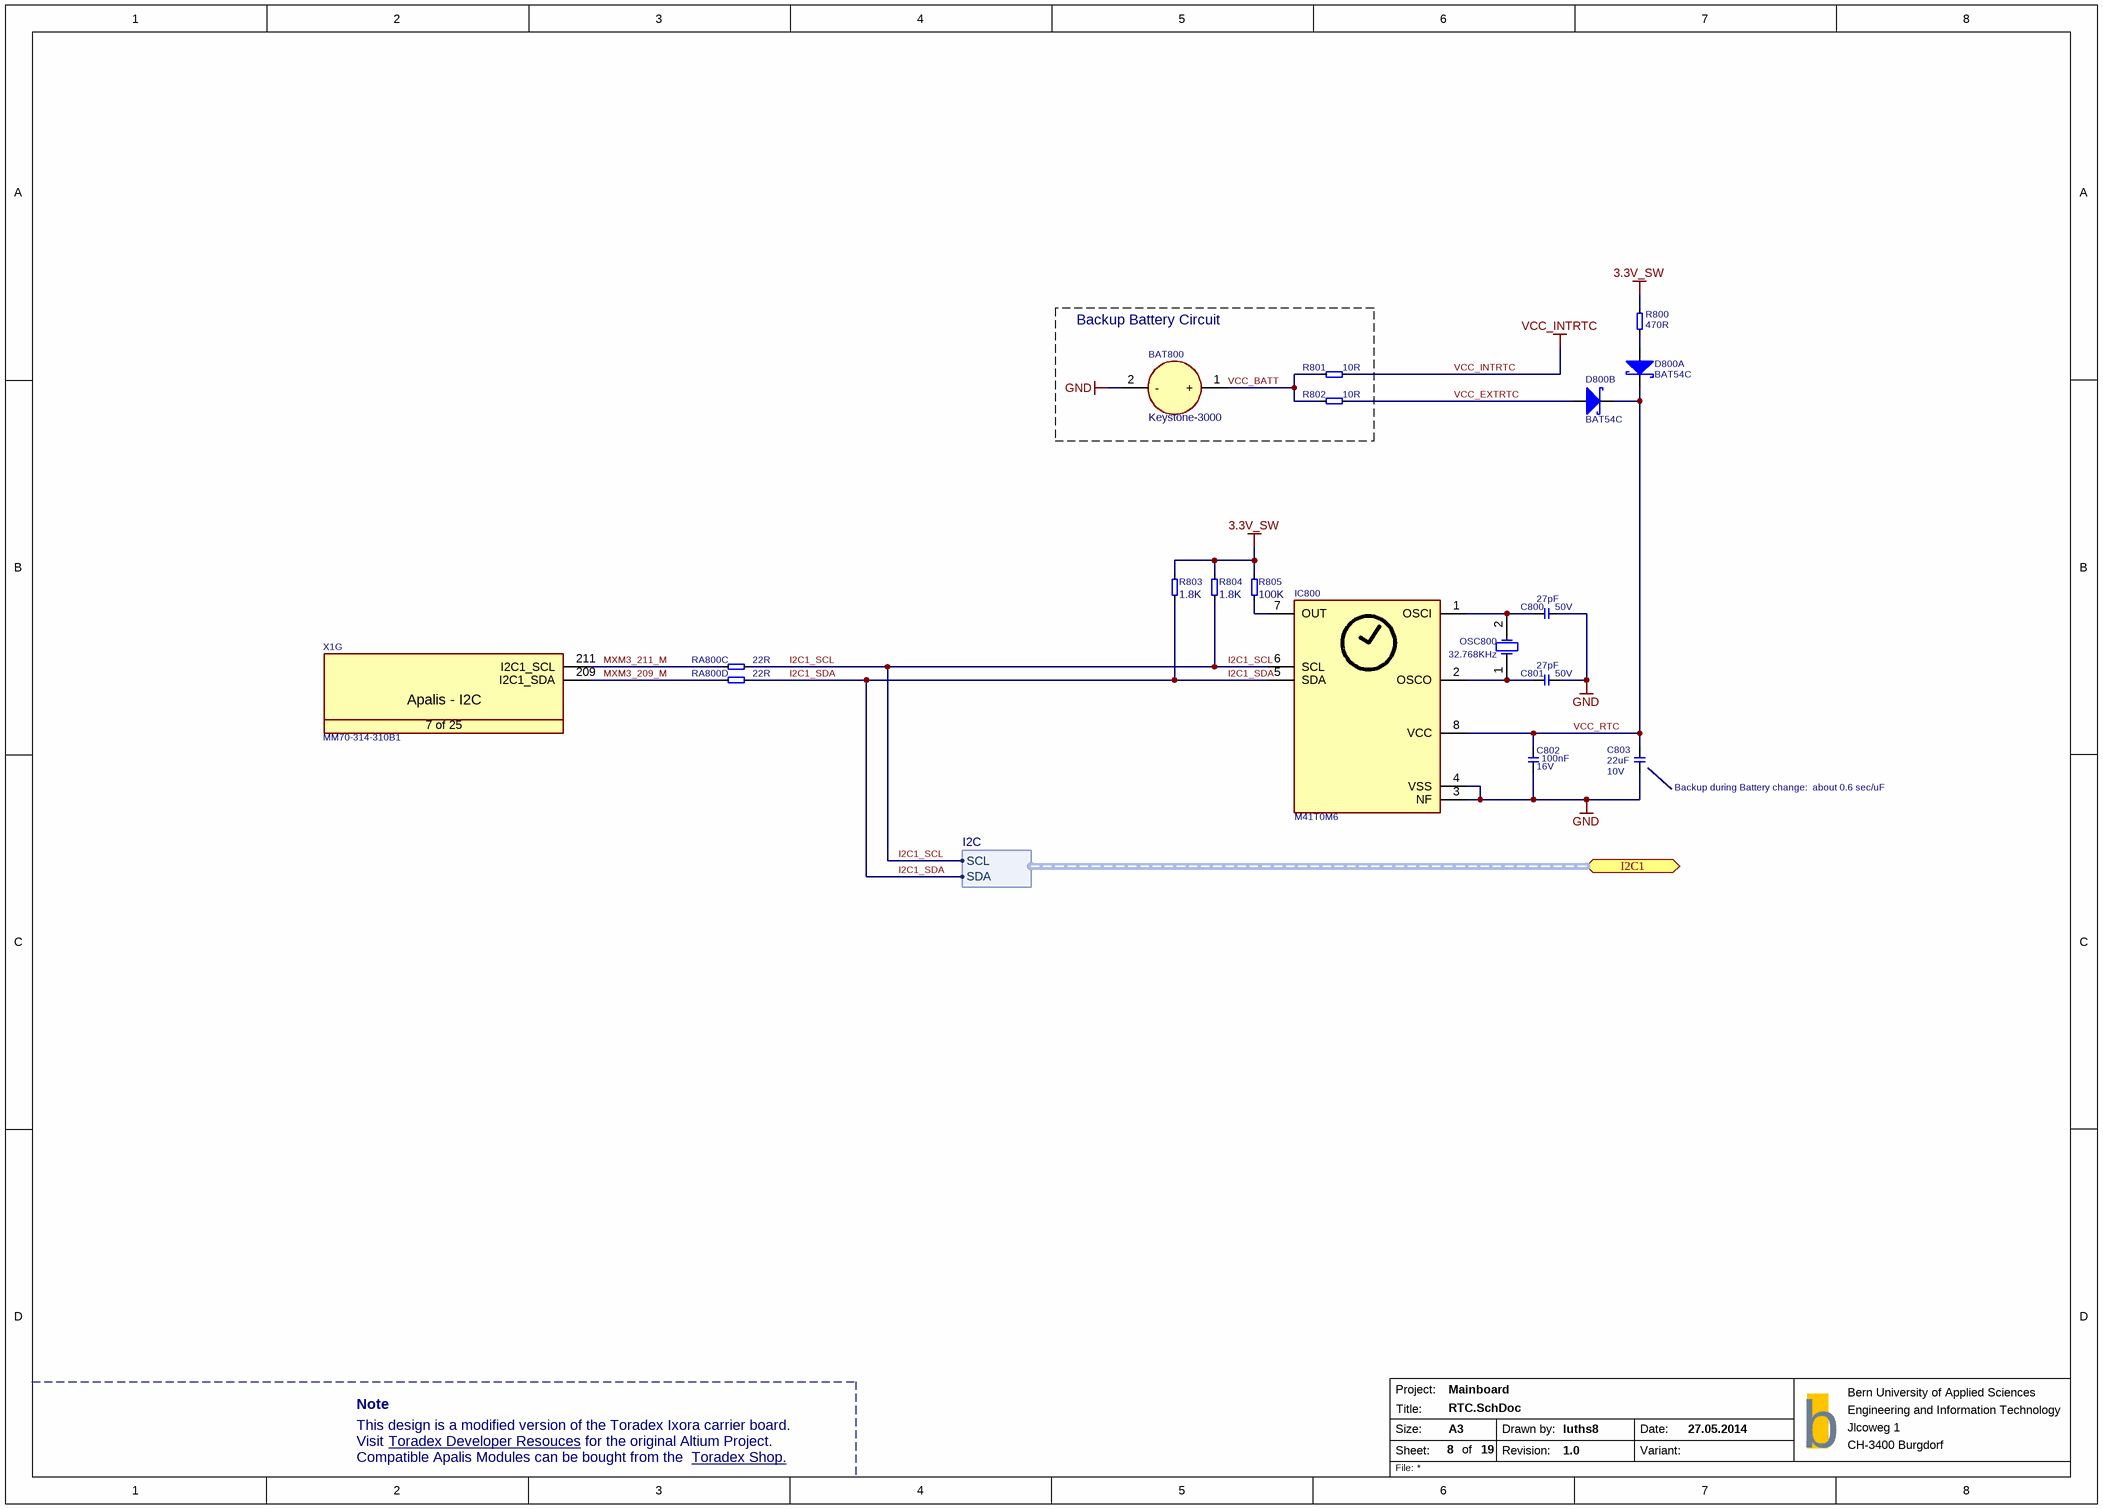
[diagram p10: RTC.SchDoc]

### Parts
BAT800  Keystone-3000  [T_Keystone_3000]
C800  Rating: 50V  [SMD0603CAP]  (hidden comment: 27pF)
C801  Rating: 50V  [SMD0603CAP]  (hidden comment: 27pF)
C802  Rating: 16V  [SMD0603CAP]  (hidden comment: 100nF)
C803  Rating: 10V  [SMD0805CAP]  (hidden comment: 22uF)
D800  BAT54C  [SOT95P230X110-3N]  (parts A,B of 2)
IC800  M41T0M6  [SOIC127P600X173-8N]
OSC800  value 32.768KHz  [T_MC_CC4V-T1A]  (hidden comment: CC4V-T1A)
R800  470R  [SMD0603RES]
R801  10R  [SMD0603RES]
R802  10R  [SMD0603RES]
R803  1.8K  [SMD0603RES]
R804  1.8K  [SMD0603RES]
R805  100K  [SMD0603RES]
RA800  22R  [T_Resistor_Array_X4]  (parts C,D of 4)
X1  Manufacturer Part No.: MM70-314-310B1  [T_JAE_MM70-314-310B1]  (hidden comment: CON-JAE-MM70-314-310B1-314-0.5mm)  (part G of 25)

### Blocks framed on the sheet
Backup Battery Circuit: BAT800 R801 R802

### Ports
I2C1 (bidir, harness I2C, see 12, 17, 18, 19)

### Harnesses
I2C: SCL, SDA

### Nets
3.3V_SW: R800.2 R803.2 R804.2 R805.2
GND: BAT800.2(-) C800.2 C801.2 C802.1 C803.2 IC800.3(NF) IC800.4(VSS)
VCC_INTRTC: R801.2
I2C1_SCL: IC800.6(SCL) R804.1 RA800.7 ; port I2C1.SCL
I2C1_SDA: IC800.5(SDA) R803.1 RA800.8 ; port I2C1.SDA
MXM3_209_M: RA800.4 X1.209(I2C1_SDA)
MXM3_211_M: RA800.3 X1.211(I2C1_SCL)
VCC_BATT: BAT800.1(+) R801.1 R802.1
VCC_EXTRTC: D800.2 R802.2
VCC_RTC: C802.2 C803.1 D800.3 IC800.8(VCC)
NetC800_1: C800.1 IC800.1(OSCI) OSC800.2(OSC2)
NetC801_1: C801.1 IC800.2(OSCO) OSC800.1(OSC1)
NetD800_1: D800.1 R800.1
NetIC800_7: IC800.7(OUT) R805.1

### Notes on the sheet
- (near C803) Backup during Battery change:  about 0.6 sec/uF
- Note
- This design is a modified version of the Toradex Ixora carrier board.
- Visit
- Compatible Apalis Modules can be bought from the
- Toradex Developer Resouces <https://developer.toradex.com/products/ixora-carrier-board>
- for the original Altium Project.
- Toradex Shop. <https://www.toradex.com/order-now/apalis-arm-family>
- Project:
- Size:
- Sheet:
- Title:
- A3
- of
- Drawn by:
- Revision:
- Date:
- Variant:
- b
- File:
- (in symbol CON-JAE-MM70-314-310B1-314-0.5mm, part G) Apalis - I2C; 7 of 25

### Library data of the parts
BAT800 = BAT-Keystone-3000: Battery Holder; Manufacturer Part No.: 3000; Manufacturer Name: Keystone
C800 C801 = C-NPO-27pF-50V-5%-0603: Capacitor Ceramic NPO 27pF 50V 5% 0603; Tolerance: 5%; Type: NPO; Value: 27pF
C802 = C-X7R-100nF-16V-10%-0402: Capacitor Ceramic X7R 100nF 16V 10% 0603; Tolerance: 10%; Type: X7R; Value: 100nF
C803 = C-X5R-22uF-10V-20%-0805: Capacitor Ceramic X5R 22uF 10V 20% 0805; Tolerance: 20%; Type: X5R; Value: 22uF
D800 = D-Philips-BAT54C-Schottky-30V-200mA: BAT54 Schottky Diode; Manufacturer: Philips; Manufacturer Part No.: BAT54C
IC800 = IC-ST-M41T0M6: RTC M41T0M6; Manufacturer Name: ST; Manufacturer Part No.: M41T0M6
OSC800 = OSC-MC-CC4V-T1A-32.768KHz-30ppm-5x1.9mm: Quartz 32.768kHz; Manufacturer Name: Micro Crystal; Tolerance: 30ppm; Manufacturer Part No.: CC4V-T1A
R800 = R-470R-63mW-5%-0402: Resistor 470 ohm 63mW 5% 0603; Rating: 63mW; Tolerance: 5%; Value: 470R
R801 R802 = R-10R-63mW-5%-0603: Resistor 10 ohm 63mW 5% 0603; Rating: 63mW; Tolerance: 5%; Value: 10R
R803 R804 = R-1.8KR-63mW-5%-0402: Resistor 1.8 Kohm 63mW 5% 0603; Value: 1.8KR; Rating: 63mW; Tolerance: 5%
R805 = R-100KR-63mW-5%-0402: as R702 on sheet Power_Switch; Rating: 63mW; Tolerance: 5%
RA800 = RA-22R-63mW-5%-1206-div: Resistor Array 22 R 63mW 5% 1206; Tolerance: 5%; Power Dissipation: 63mW; Value: 22R
X1 = CON-JAE-MM70-314-310B1-314-0.5mm: as X1 on sheet Power_Switch

## Sheet Sata.SchDoc
size A3; PageSetup: Record=PageOptions|CenterHorizontal=True|CenterVertical=True|PrintScale=0.73|XCorrection=1.00|YCorrection=1.00|PrintKind=0|BorderSize=5000000|LeftOffset=0|BottomOffset=0|Orientation=2|PaperLength=1000|PaperWidth=1000|Scale=100|PaperSource=7|PrintQuality=-4|MediaType=1|DitherType=10|PaperKind=A4|PrintScaleMode=1; Date: 27.05.2014; DrawnBy: luths8; Organization: BFH; Address1: Bern University of Applied Sciences; Address2: Engineering and Information Technology; Address3: Jlcoweg 1; Address4: CH-3400 Burgdorf; DocumentNumber: 13; Revision: 1.0; SheetNumber: 16; SheetTotal: 19; CurrentDate: 27.05.2014
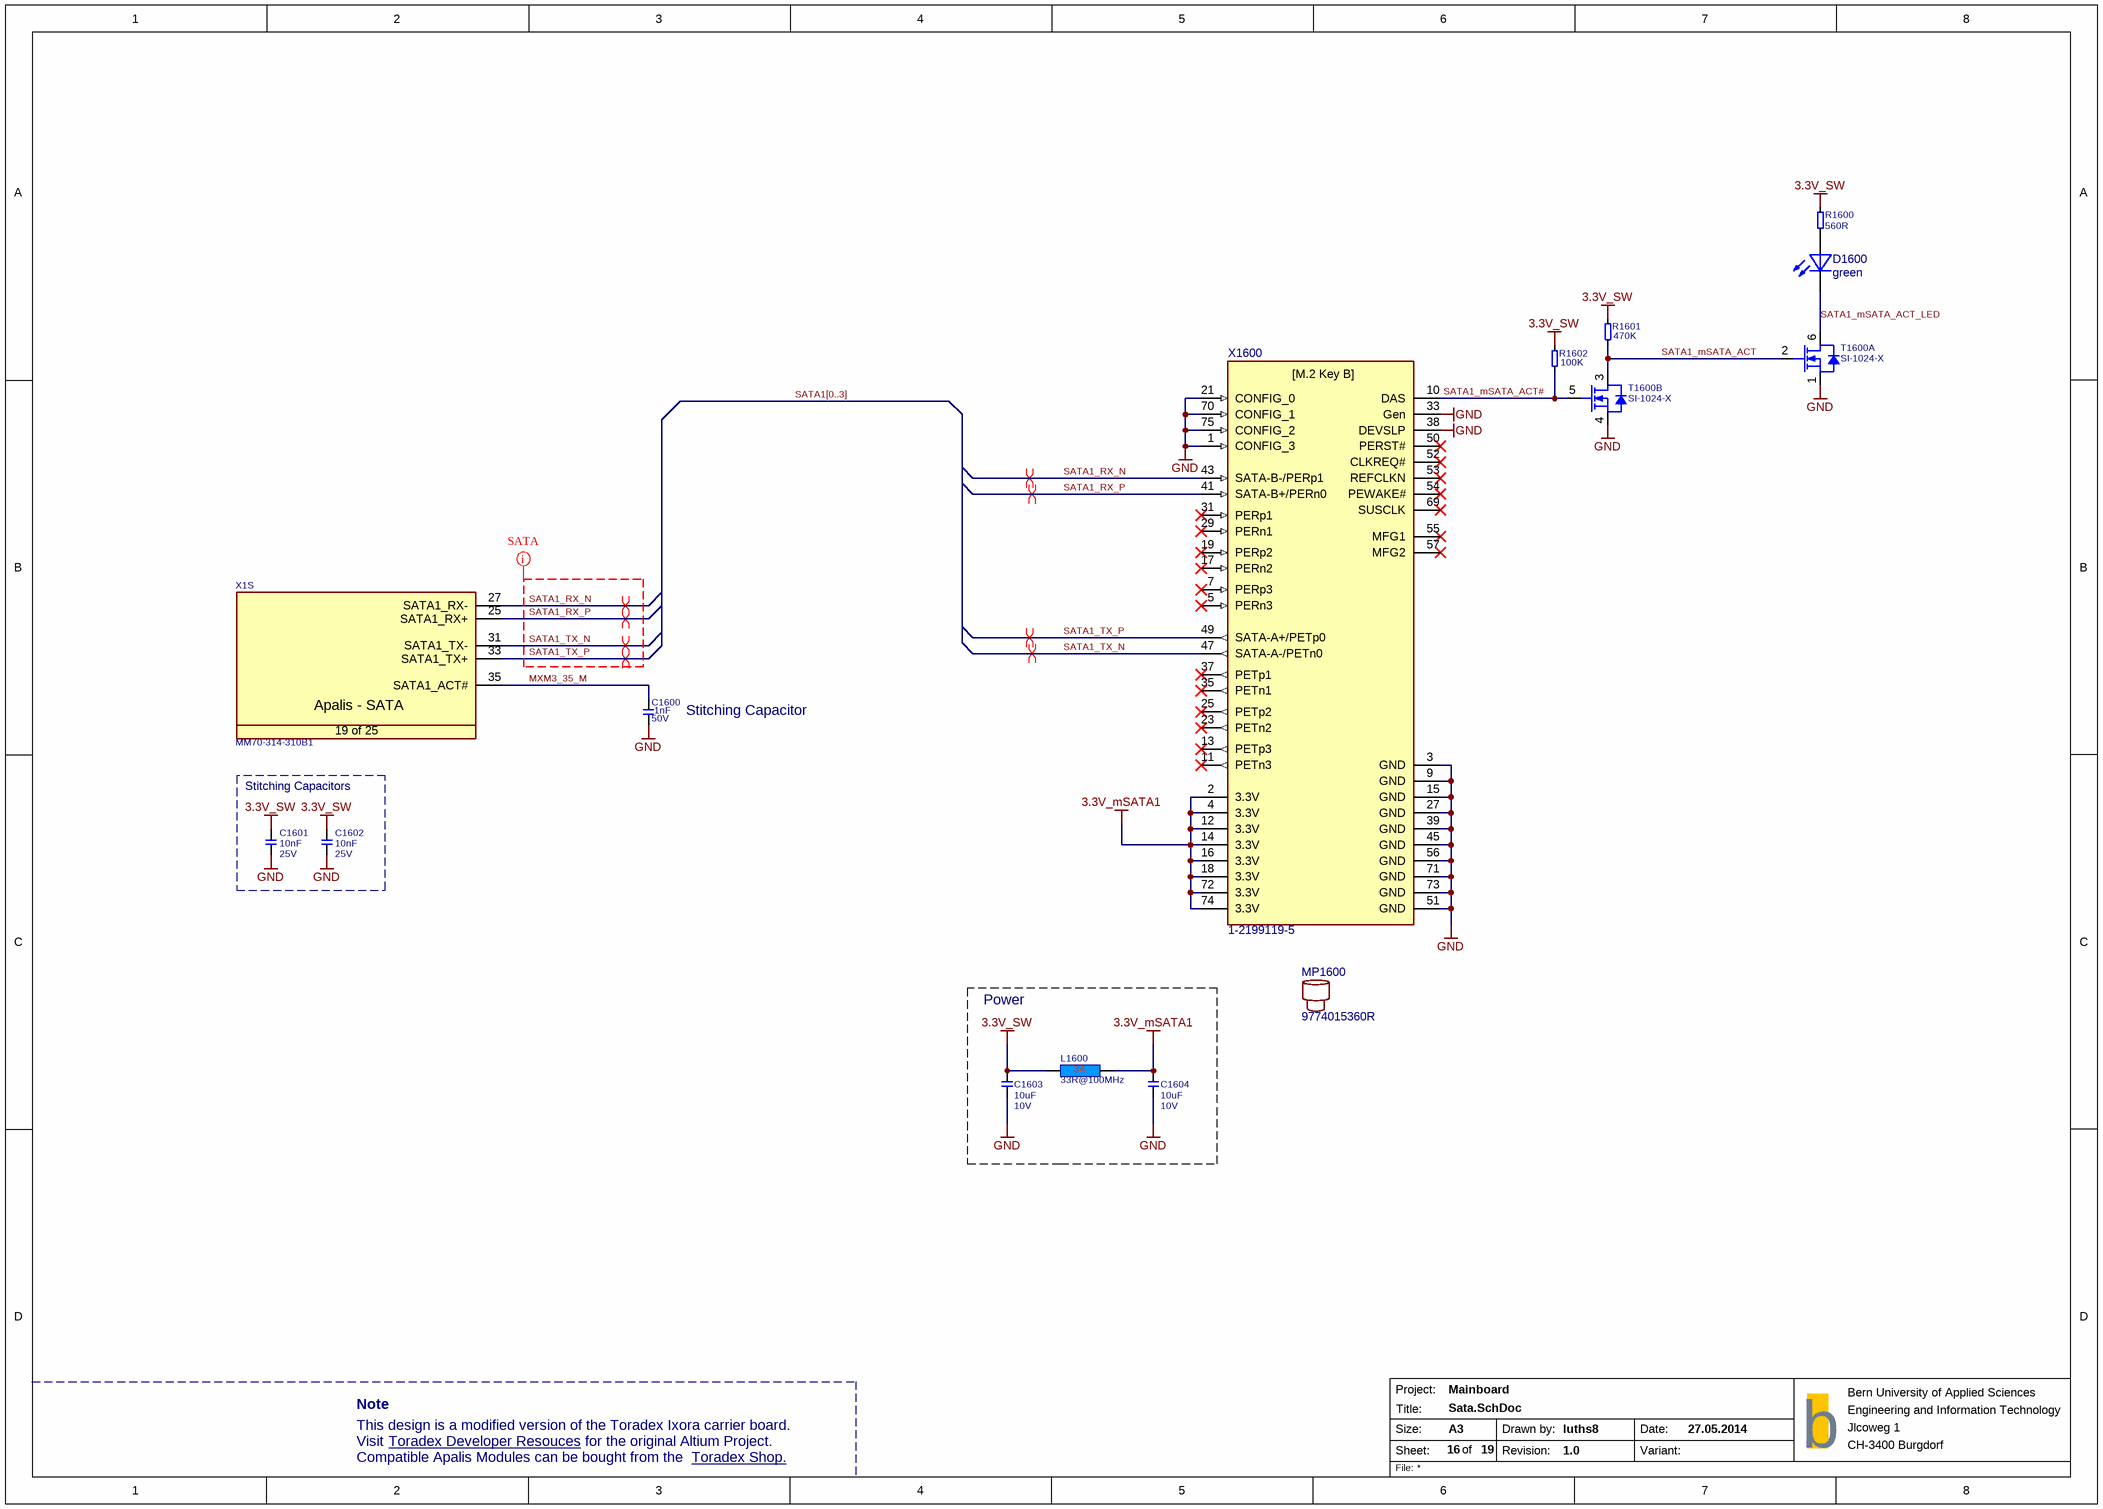
[diagram p11: Sata.SchDoc]

### Parts
C1600  Rating: 50V  [SMD0603CAP]  (hidden comment: 1nF)
C1601  10nF  Rating: 25V  [SMD0603CAP]
C1602  10nF  Rating: 25V  [SMD0603CAP]
C1603  Rating: 10V  [SMD0603CAP]  (hidden comment: 10uF)
C1604  Rating: 10V  [SMD0603CAP]  (hidden comment: 10uF)
D1600  green  [LED]
L1600  33R@100MHz  [INDC1608X95N]
MP1600  9774015360R
R1600  560R  [SMD0603RES]
R1601  470K  [SMD0603RES]
R1602  100K  [SMD0603RES]
T1600  Manufacturer Part No.: SI-1024-X  [SOTFL50P160X60-6N]  (hidden comment: T-Vishay-SI-1024X-N)  (parts A,B of 2)
X1  Manufacturer Part No.: MM70-314-310B1  [T_JAE_MM70-314-310B1]  (hidden comment: CON-JAE-MM70-314-310B1-314-0.5mm)  (part S of 25)
X1600  1-2199119-5  [1-2199119-5-Key-M-2280]

### Blocks framed on the sheet
Stitching Capacitors: C1601 C1602
Power: C1603 C1604 L1600

### Nets
3.3V_mSATA1: C1604.2 L1600.2 X1600.2(3.3V) X1600.4(3.3V) X1600.12(3.3V) X1600.14(3.3V) X1600.16(3.3V) X1600.18(3.3V) X1600.72(3.3V) X1600.74(3.3V)
3.3V_SW: C1601.2 C1602.2 C1603.2 L1600.1 R1600.1 R1601.1 R1602.2
GND: C1600.1 C1601.1 C1602.1 C1603.1 C1604.1 T1600.1(S) T1600.4(S) X1600.1(CONFIG_3) X1600.3(GND) X1600.9(GND) X1600.15(GND) X1600.21(CONFIG_0) X1600.27(GND) X1600.33(Gen) X1600.38(DEVSLP) X1600.39(GND) X1600.45(GND) X1600.51(GND) X1600.56(GND) X1600.70(CONFIG_1) X1600.71(GND) X1600.73(GND) X1600.75(CONFIG_2)
MXM3_35_M: C1600.2 X1.35(SATA1_ACT#)
SATA1_mSATA_ACT: R1601.2 T1600.2(G) T1600.3(D)
SATA1_mSATA_ACT#: R1602.1 T1600.5(G) X1600.10(DAS)
SATA1_mSATA_ACT_LED: D1600.C T1600.6(D)
SATA1_RX_N: X1.27(SATA1_RX-) X1600.43(SATA-B-/PERp1)
SATA1_RX_P: X1.25(SATA1_RX+) X1600.41(SATA-B+/PERn0)
SATA1_TX_N: X1.31(SATA1_TX-) X1600.47(SATA-A-/PETn0)
SATA1_TX_P: X1.33(SATA1_TX+) X1600.49(SATA-A+/PETp0)
NetD1600_A: D1600.A R1600.2

Not connected (* = marked no-connect by the designer): X1600 5(PERn3)* 7(PERp3)* 11(PETn3)* 13(PETp3)* 17(PERn2)* 19(PERp2)* 23(PETn2)* 25(PETp2)* 29(PERn1)* 31(PERp1)* 35(PETn1)* 37(PETp1)* 50(PERST#)* 52(CLKREQ#)* 53(REFCLKN)* 54(PEWAKE#)* 55(MFG1)* 57(MFG2)* 69(SUSCLK)*

### Buses and harness runs
bus SATA1[0..3]

### Layout directives
differential pair: SATA1_RX_N, SATA1_RX_P, SATA1_TX_N, SATA1_TX_P
net class SATA: SATA1_RX_N, SATA1_RX_P, SATA1_TX_N, SATA1_TX_P

### Notes on the sheet
- (near C1600) Stitching Capacitor
- Note
- This design is a modified version of the Toradex Ixora carrier board.
- Visit
- Compatible Apalis Modules can be bought from the
- Toradex Developer Resouces <https://developer.toradex.com/products/ixora-carrier-board>
- for the original Altium Project.
- Toradex Shop. <https://www.toradex.com/order-now/apalis-arm-family>
- Project:
- Size:
- Sheet:
- Title:
- A3
- of
- Drawn by:
- Revision:
- Date:
- Variant:
- b
- File:
- (in symbol CON-JAE-MM70-314-310B1-314-0.5mm, part S) Apalis - SATA; 19 of 25

### Library data of the parts
C1600 = C-X7R-1nF-50V-10%-0402: Capacitor Ceramic X7R 1nF 50V 10% 0603; Tolerance: 10%; Type: X7R; Value: 1nF
C1601 C1602 = C-X7R-10nF-25V-10%-0603: Capacitor Ceramic X7R 10nF 25V 10% 0603; Tolerance: 10%; Type: X7R; Value: 10nF
C1603 C1604 = C-X5R-10uF-10V-20%-0603: Capacitor Ceramic X5R 10uF 10V 20% 0603; Tolerance: 20%; Type: X5R; Value: 10uF
D1600 = LED green: Manufacturer Part No.: LGM67KG1J224Z
L1600 = L-33R@100MHz-3A-25%-0603: 33R@100MHz 3A EMI FILTER; Tolerance: 25%; Rating: 3A; Value: 33R@100MHz
MP1600 = Spacer M3 SMD: Manufacturer Part No.: 9774015360R
R1600 = R-560R-63mW-5%-0402: Resistor 560 ohm 63mW 5% 0603; Rating: 63mW; Tolerance: 5%; Value: 560R
R1601 = R-470KR-63mW-5%-0402: Resistor 470 Kohm 63mW 5% 0603; Value: 470KR; Rating: 63mW; Tolerance: 5%
R1602 = R-100KR-63mW-5%-0402: as R702 on sheet Power_Switch; Rating: 63mW; Tolerance: 5%
T1600 = T-Vishay-SI-1024X-N: as T702 on sheet Power_Switch
X1 = CON-JAE-MM70-314-310B1-314-0.5mm: as X1 on sheet Power_Switch
X1600 = Connector M.2 Key M: Manufacturer Part No.: 1-2199119-5

## Sheet Serial.SchDoc
size A3; PageSetup: Record=PageOptions|CenterHorizontal=True|CenterVertical=True|PrintScale=0.73|XCorrection=1.00|YCorrection=1.00|PrintKind=0|BorderSize=5000000|LeftOffset=0|BottomOffset=0|Orientation=2|PaperLength=1000|PaperWidth=1000|Scale=100|PaperSource=7|PrintQuality=-4|MediaType=1|DitherType=10|PaperKind=A4|PrintScaleMode=1; Date: 27.05.2014; DrawnBy: luths8; Organization: BFH; Address1: Bern University of Applied Sciences; Address2: Engineering and Information Technology; Address3: Jlcoweg 1; Address4: CH-3400 Burgdorf; DocumentNumber: 12; Revision: 1.0; SheetNumber: 15; SheetTotal: 19; CurrentDate: 27.05.2014
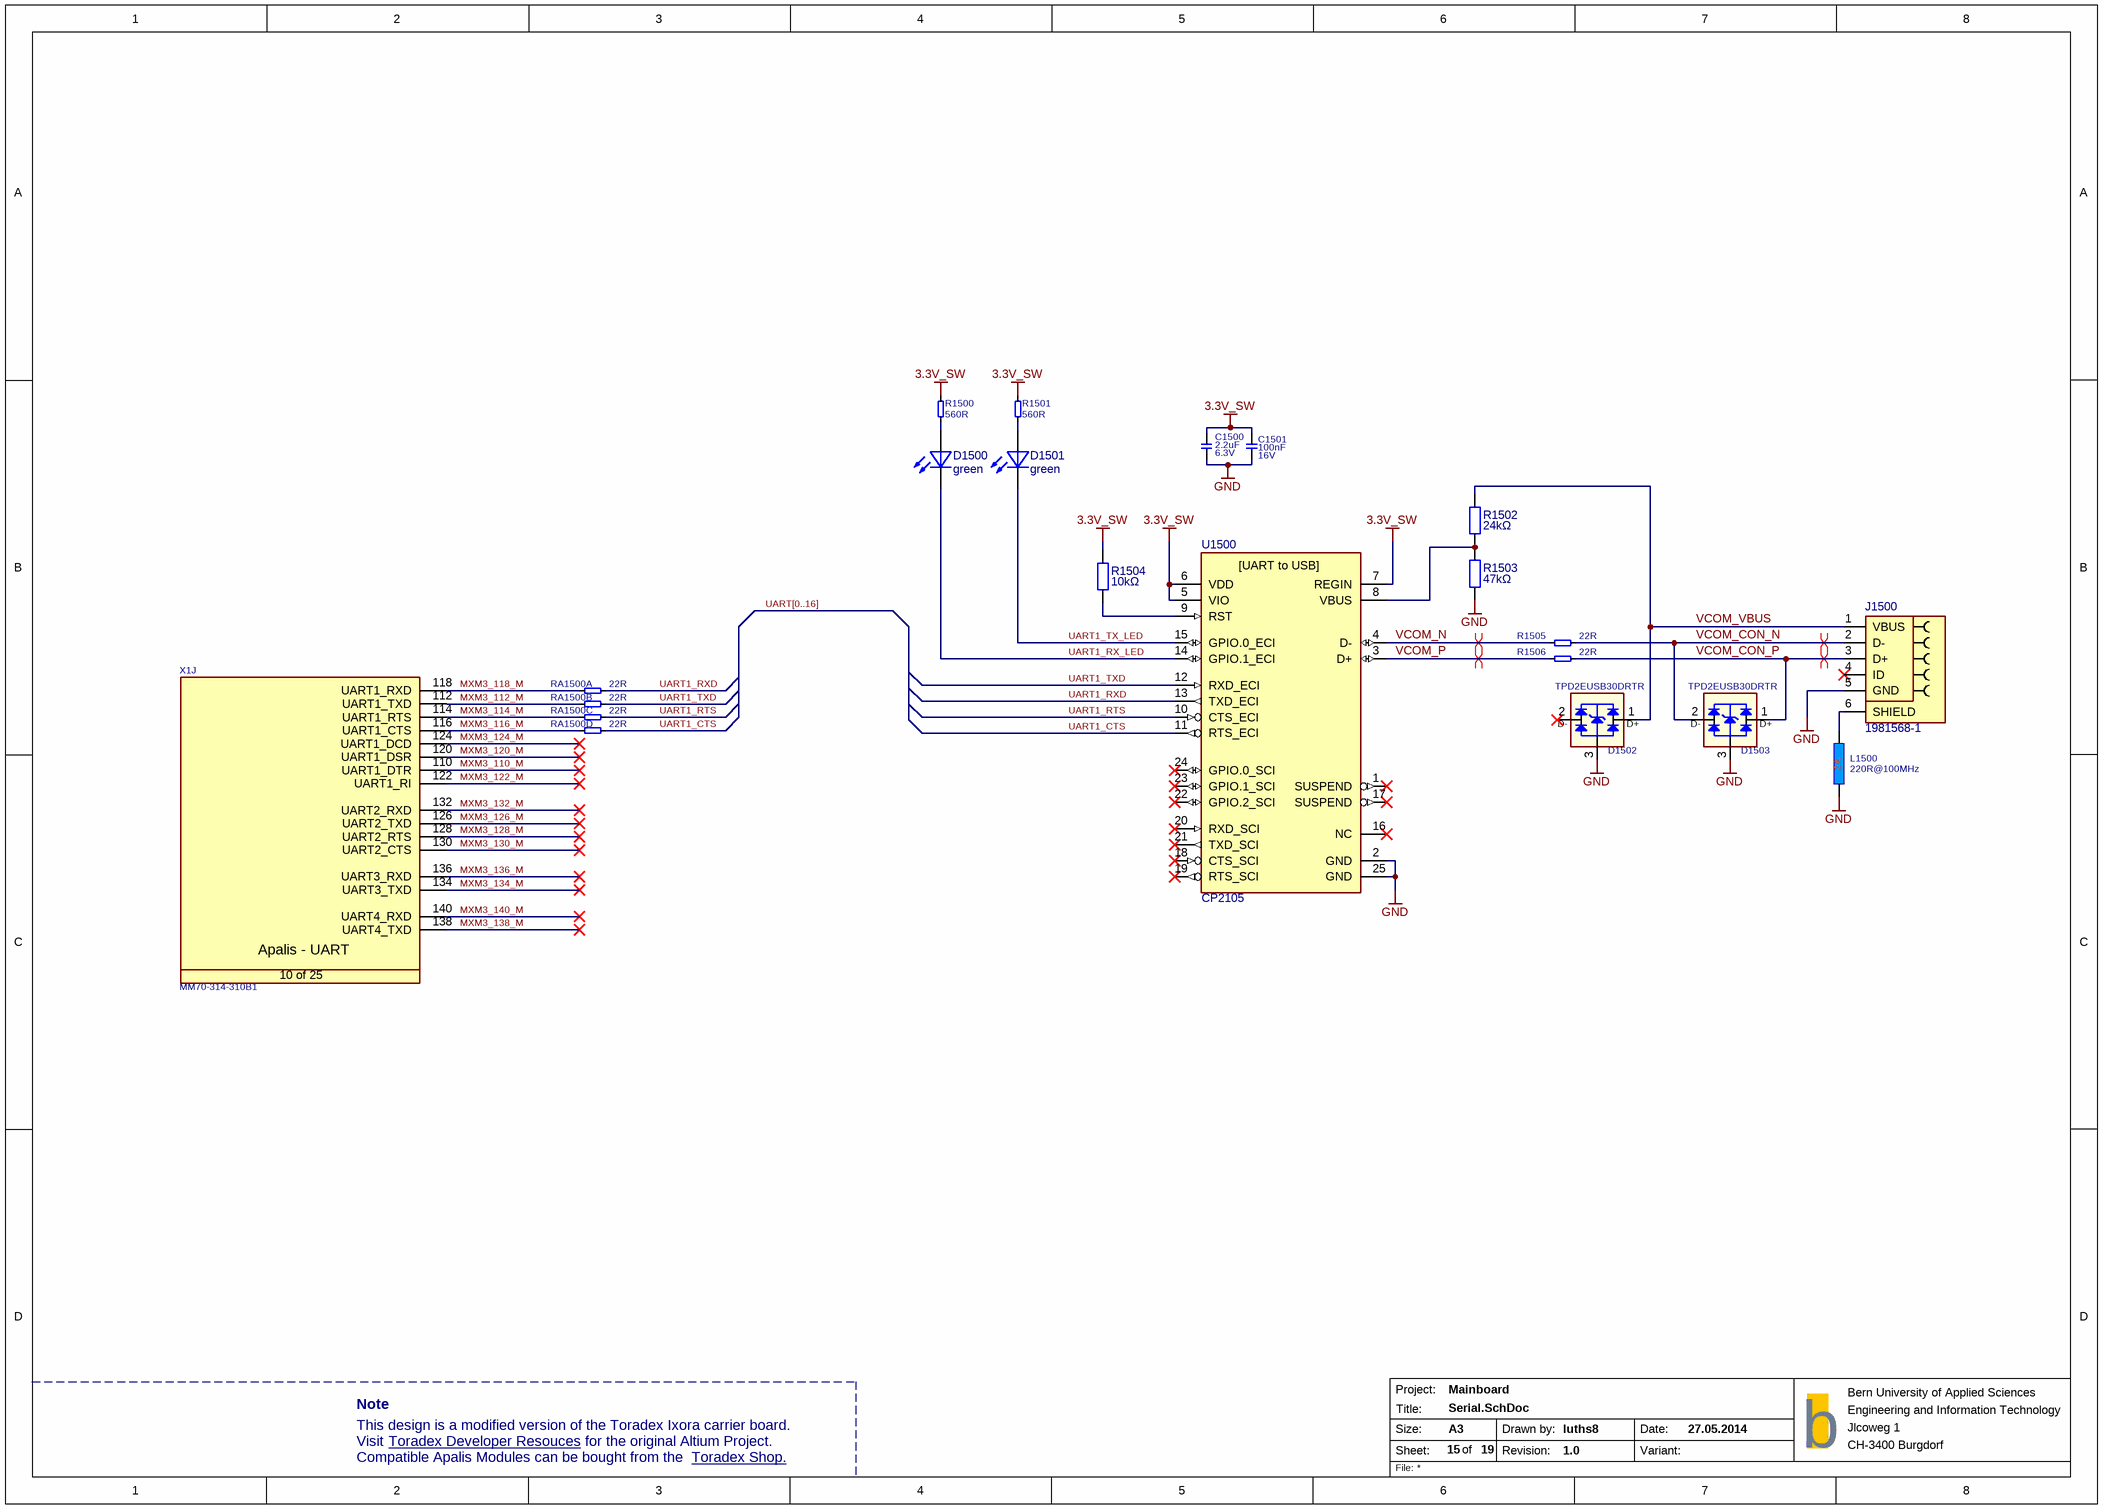
[diagram p12: Serial.SchDoc]

### Parts
C1500  Rating: 6.3V  [SMD0603CAP]  (hidden comment: 2.2uF)
C1501  Rating: 16V  [SMD0603CAP]  (hidden comment: 100nF)
D1500  green  [LED]
D1501  green  [LED]
D1502  TPD2EUSB30DRTR  [T_TI_TPD2EUSB30DRTR]
D1503  TPD2EUSB30DRTR  [T_TI_TPD2EUSB30DRTR]
J1500  1981568-1  [HEADER_USB]
L1500  220R@100MHz  [INDC1608X95N]
R1500  560R  [SMD0603RES]
R1501  560R  [SMD0603RES]
R1502  24kΩ  [SMD0603RES]
R1503  47kΩ  [SMD0603RES]
R1504  10kΩ  [SMD0603RES]
R1505  22R  [SMD0603RES]
R1506  22R  [SMD0603RES]
RA1500  22R  [T_Resistor_Array_X4]  (parts A,B,C,D of 4)
U1500  CP2105  [QFN24]
X1  Manufacturer Part No.: MM70-314-310B1  [T_JAE_MM70-314-310B1]  (hidden comment: CON-JAE-MM70-314-310B1-314-0.5mm)  (part J of 25)

### Nets
3.3V_SW: C1500.2 C1501.2 R1500.1 R1501.1 R1504.2 U1500.5(VIO) U1500.6(VDD) U1500.7(REGIN)
GND: C1500.1 C1501.1 D1502.3 D1503.3 J1500.5(GND) L1500.1 R1503.1 U1500.2(GND) U1500.25(GND)
MXM3_110_M: X1.110(UART1_DTR)
MXM3_112_M: RA1500.1 X1.112(UART1_TXD)
MXM3_114_M: RA1500.2 X1.114(UART1_RTS)
MXM3_116_M: RA1500.3 X1.116(UART1_CTS)
MXM3_118_M: RA1500.4 X1.118(UART1_RXD)
MXM3_120_M: X1.120(UART1_DSR)
MXM3_122_M: X1.122(UART1_RI)
MXM3_124_M: X1.124(UART1_DCD)
MXM3_126_M: X1.126(UART2_TXD)
MXM3_128_M: X1.128(UART2_RTS)
MXM3_130_M: X1.130(UART2_CTS)
MXM3_132_M: X1.132(UART2_RXD)
MXM3_134_M: X1.134(UART3_TXD)
MXM3_136_M: X1.136(UART3_RXD)
MXM3_138_M: X1.138(UART4_TXD)
MXM3_140_M: X1.140(UART4_RXD)
UART1_CTS: RA1500.7 U1500.11(RTS_ECI)
UART1_RTS: RA1500.6 U1500.10(CTS_ECI)
UART1_RX_LED: D1500.C U1500.14(GPIO.1_ECI)
UART1_RXD: RA1500.8 U1500.13(TXD_ECI)
UART1_TX_LED: D1501.C U1500.15(GPIO.0_ECI)
UART1_TXD: RA1500.5 U1500.12(RXD_ECI)
VCOM_CON_N: D1503.2(D-) J1500.2(D-) R1505.2
VCOM_CON_P: D1503.1(D+) J1500.3(D+) R1506.2
VCOM_N: R1505.1 U1500.4(D-)
VCOM_P: R1506.1 U1500.3(D+)
VCOM_VBUS: D1502.1(D+) J1500.1(VBUS) R1502.2
NetD1500_A: D1500.A R1500.2
NetD1501_A: D1501.A R1501.2
NetJ1500_6: J1500.6(SHIELD) L1500.2
NetR1502_1: R1502.1 R1503.2 U1500.8(VBUS)
NetR1504_1: R1504.1 U1500.9(RST)

Not connected (* = marked no-connect by the designer): D1502 2(D-)*; J1500 4(ID)*; U1500 1(SUSPEND)* 16(NC)* 17(SUSPEND)* 18(CTS_SCI)* 19(RTS_SCI)* 20(RXD_SCI)* 21(TXD_SCI)* 22(GPIO.2_SCI)* 23(GPIO.1_SCI)* 24(GPIO.0_SCI)*

### Buses and harness runs
bus UART[0..16]

### Layout directives
differential pair: VCOM_CON_N, VCOM_CON_P, VCOM_N, VCOM_P

### Notes on the sheet
- Note
- This design is a modified version of the Toradex Ixora carrier board.
- Visit
- Compatible Apalis Modules can be bought from the
- Toradex Developer Resouces <https://developer.toradex.com/products/ixora-carrier-board>
- for the original Altium Project.
- Toradex Shop. <https://www.toradex.com/order-now/apalis-arm-family>
- Project:
- Size:
- Sheet:
- Title:
- A3
- of
- Drawn by:
- Revision:
- Date:
- Variant:
- b
- File:
- (in symbol CON-JAE-MM70-314-310B1-314-0.5mm, part J) Apalis - UART; 10 of 25
- (in symbol CP2105) [UART to USB]

### Library data of the parts
C1500 = C-X5R-2.2uF-6.3V-20%-0603: as C729 on sheet Power_Switch; Tolerance: 20%; Type: X5R; Value: 2.2uF
C1501 = C-X7R-100nF-16V-10%-0402: Capacitor Ceramic X7R 100nF 16V 10% 0603; Tolerance: 10%; Type: X7R; Value: 100nF
D1500 D1501 = LED green: Manufacturer Part No.: LGM67KG1J224Z
D1502 D1503 = D-TI-TPD2EUSB30DRTR: 2 Channel Protection for Super Speed USB3.0; Manufacturer Name: TI; Manufacturer Part No.: TPD2EUSB30DRTR
J1500 = Connector USB: USB Micro Connector; Manufacturer Part No.: 1981568-1
L1500 = L-220R@100MHz-2A-25%-0603: as L702 on sheet Power_Switch; Rating: 2A; Value: 220R@100MHz
R1500 R1501 = R-560R-63mW-5%-0402: Resistor 560 ohm 63mW 5% 0603; Rating: 63mW; Tolerance: 5%; Value: 560R
R1502-R1504 = Resistor
R1505 R1506 = R-22R-63mW-5%-0402: Resistor 22 ohm 63mW 5% 0603; Rating: 63mW; Tolerance: 5%; Value: 22R
RA1500 = RA-22R-63mW-5%-1206-div: Resistor Array 22 R 63mW 5% 1206; Tolerance: 5%; Power Dissipation: 63mW; Value: 22R
U1500 = CP2105: USB to UART Bridge; Manufacturer Part No.: CP2105-F01-GMR
X1 = CON-JAE-MM70-314-310B1-314-0.5mm: as X1 on sheet Power_Switch

## Sheet Extension.SchDoc
size A3; PageSetup: Record=PageOptions|CenterHorizontal=True|CenterVertical=True|PrintScale=0.73|XCorrection=1.00|YCorrection=1.00|PrintKind=0|BorderSize=5000000|LeftOffset=0|BottomOffset=0|Orientation=2|PaperLength=1000|PaperWidth=1000|Scale=100|PaperSource=7|PrintQuality=-4|MediaType=1|DitherType=10|PaperKind=A4|PrintScaleMode=1; Date: 27.05.2014; DrawnBy: luths8; Organization: BFH; Address1: Bern University of Applied Sciences; Address2: Engineering and Information Technology; Address3: Jlcoweg 1; Address4: CH-3400 Burgdorf; DocumentNumber: 15; Revision: 1.0; SheetNumber: 18; SheetTotal: 19; CurrentDate: 27.05.2014
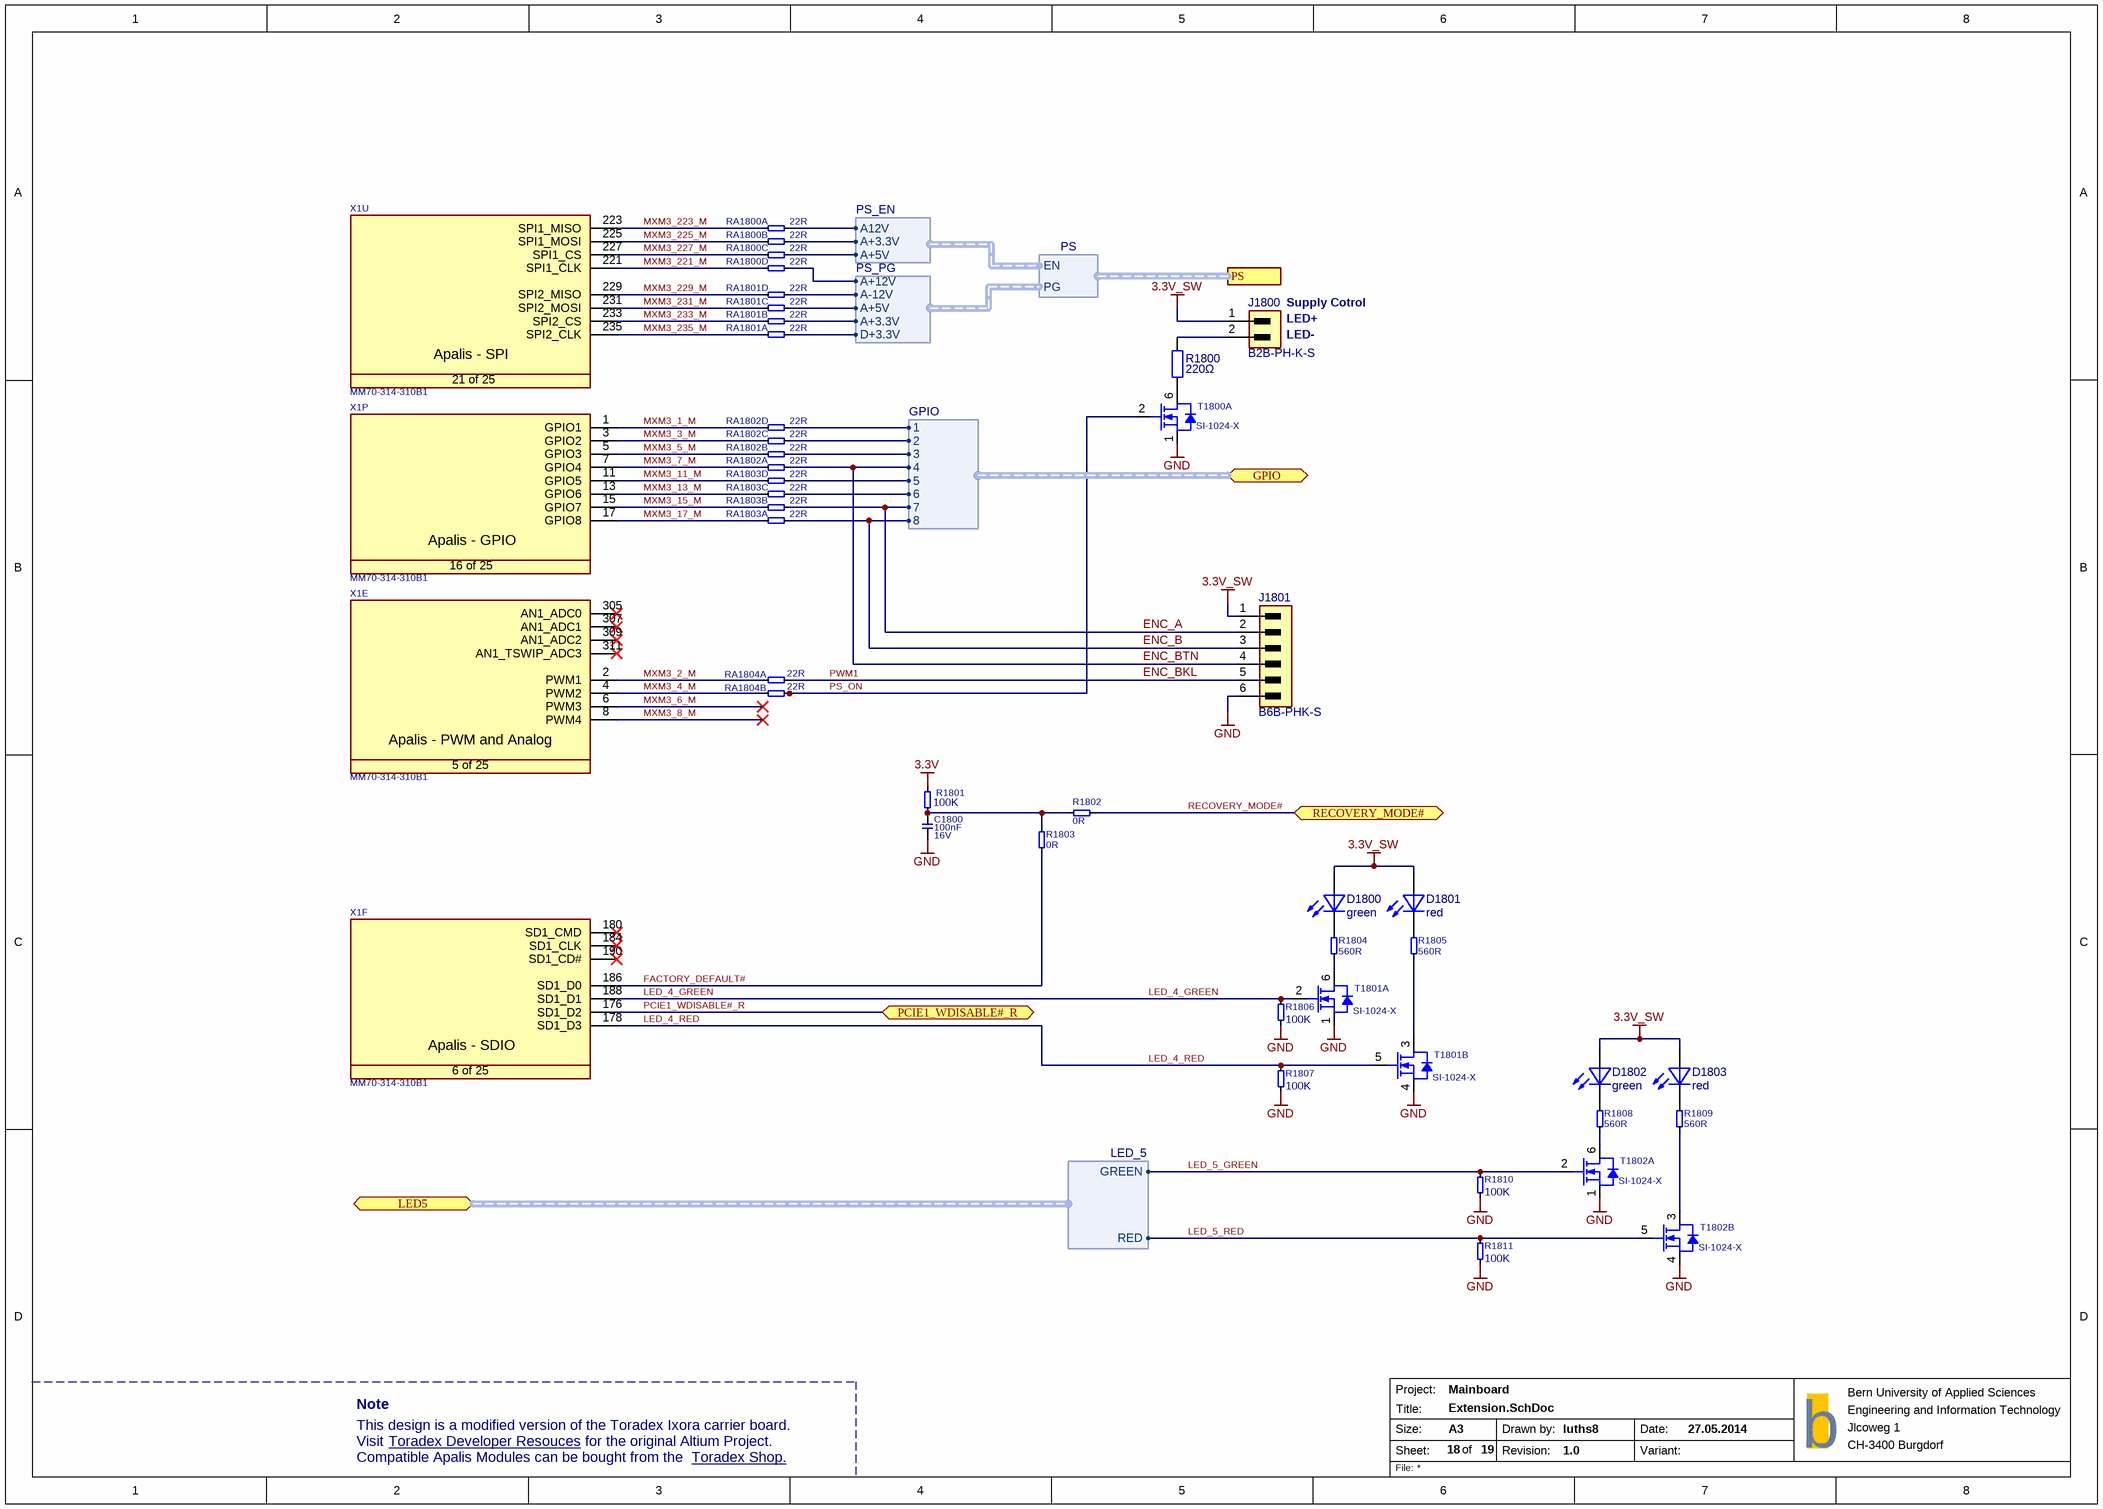
[diagram p13: Extension.SchDoc]

### Parts
C1800  Rating: 16V  [SMD0603CAP]  (hidden comment: 100nF)
D1800  green  [LED]
D1801  red  [LED]
D1802  green  [LED]
D1803  red  [LED]
J1800  B2B-PH-K-S  [B2B-PH-K-S]
J1801  B6B-PHK-S  [B6B-PH-K-S]
R1800  220Ω  [SMD0603RES]
R1801  100K  [SMD0603RES]
R1802  0R  [SMD0603RES]
R1803  0R  [SMD0603RES]
R1804  560R  [SMD0603RES]
R1805  560R  [SMD0603RES]
R1806  100K  [SMD0603RES]
R1807  100K  [SMD0603RES]
R1808  560R  [SMD0603RES]
R1809  560R  [SMD0603RES]
R1810  100K  [SMD0603RES]
R1811  100K  [SMD0603RES]
RA1800  22R  [T_Resistor_Array_X4]  (parts A,B,C,D of 4)
RA1801  22R  [T_Resistor_Array_X4]  (parts A,B,C,D of 4)
RA1802  22R  [T_Resistor_Array_X4]  (parts A,B,C,D of 4)
RA1803  22R  [T_Resistor_Array_X4]  (parts A,B,C,D of 4)
RA1804  22R  [T_Resistor_Array_X4]  (parts A,B of 4)
T1800  Manufacturer Part No.: SI-1024-X  [SOTFL50P160X60-6N]  (hidden comment: T-Vishay-SI-1024X-N)  (part A of 2)
T1801  Manufacturer Part No.: SI-1024-X  [SOTFL50P160X60-6N]  (hidden comment: T-Vishay-SI-1024X-N)  (parts A,B of 2)
T1802  Manufacturer Part No.: SI-1024-X  [SOTFL50P160X60-6N]  (hidden comment: T-Vishay-SI-1024X-N)  (parts A,B of 2)
X1  Manufacturer Part No.: MM70-314-310B1  [T_JAE_MM70-314-310B1]  (hidden comment: CON-JAE-MM70-314-310B1-314-0.5mm)  (parts E,F,P,U of 25)

### Ports
GPIO (bidir, harness GPIO, see 11, 12, 4), LED5 (bidir, harness LED_5, see 8), PCIE1_WDISABLE#_R (bidir, see 18), PS (harness PS), RECOVERY_MODE# (bidir, see 11)

### Harnesses
LED_5: GREEN, RED
PS: EN, PG
GPIO: 1, 2, 3, 4, 5, 6, 7, 8
PS_EN: A12V, A+3.3V, A+5V
PS_PG: A+12V, A-12V, A+3.3V, A+5V, D+3.3V

### Nets
3.3V: R1801.1
3.3V_SW: D1800.A D1801.A D1802.A D1803.A J1800.1 J1801.1
GND: C1800.1 J1801.6 R1806.2 R1807.2 R1810.2 R1811.2 T1800.1(S) T1801.1(S) T1801.4(S) T1802.1(S) T1802.4(S)
DAC_MUTE: RA1802.8 ; port GPIO.1
ENC_A: J1801.2 RA1803.6 ; port GPIO.7
ENC_B: J1801.3 RA1803.5 ; port GPIO.8
ENC_BKL: J1801.5 RA1804.1  [also labelled PWM1]
ENC_BTN: J1801.4 RA1802.5 ; port GPIO.4
FACTORY_DEFAULT#: R1803.1 X1.186(SD1_D0)
LED_4_GREEN: R1806.1 T1801.2(G) X1.188(SD1_D1)
LED_4_RED: R1807.1 T1801.5(G) X1.178(SD1_D3)
LED_5_GREEN: R1810.1 T1802.2(G) ; port LED5.GREEN
LED_5_RED: R1811.1 T1802.5(G) ; port LED5.RED
MXM3_1_M: RA1802.4 X1.1(GPIO1)
MXM3_2_M: RA1804.5 X1.2(PWM1)
MXM3_3_M: RA1802.3 X1.3(GPIO2)
MXM3_4_M: RA1804.6 X1.4(PWM2)
MXM3_5_M: RA1802.2 X1.5(GPIO3)
MXM3_6_M: X1.6(PWM3)
MXM3_7_M: RA1802.1 X1.7(GPIO4)
MXM3_8_M: X1.8(PWM4)
MXM3_11_M: RA1803.4 X1.11(GPIO5)
MXM3_13_M: RA1803.3 X1.13(GPIO6)
MXM3_15_M: RA1803.2 X1.15(GPIO7)
MXM3_17_M: RA1803.1 X1.17(GPIO8)
MXM3_221_M: RA1800.4 X1.221(SPI1_CLK)
MXM3_223_M: RA1800.1 X1.223(SPI1_MISO)
MXM3_225_M: RA1800.2 X1.225(SPI1_MOSI)
MXM3_227_M: RA1800.3 X1.227(SPI1_CS)
MXM3_229_M: RA1801.4 X1.229(SPI2_MISO)
MXM3_231_M: RA1801.3 X1.231(SPI2_MOSI)
MXM3_233_M: RA1801.2 X1.233(SPI2_CS)
MXM3_235_M: RA1801.1 X1.235(SPI2_CLK)
PCIE1_WDISABLE#_R: X1.176(SD1_D2) ; port PCIE1_WDISABLE#_R
PS_ON: RA1804.2 T1800.2(G)
RECOVERY_MODE#: R1802.2 ; port RECOVERY_MODE#
TOUCH_INT#: RA1803.8 ; port GPIO.5
TOUCH_RESET#: RA1803.7 ; port GPIO.6
NetC1800_2: C1800.2 R1801.2 R1802.1 R1803.2
NetD1800_C: D1800.C R1804.2
NetD1801_C: D1801.C R1805.2
NetD1802_C: D1802.C R1808.1
NetD1803_C: D1803.C R1809.1
NetJ1800_2: J1800.2 R1800.2
NetR1800_1: R1800.1 T1800.6(D)
NetR1804_1: R1804.1 T1801.6(D)
NetR1805_1: R1805.1 T1801.3(D)
NetR1808_2: R1808.2 T1802.6(D)
NetR1809_2: R1809.2 T1802.3(D)
NetRA1800_5: RA1800.5 ; harness PS_EN.A12V
NetRA1800_6: RA1800.6 ; harness PS_EN.A+3.3V
NetRA1800_7: RA1800.7 ; harness PS_EN.A+5V
NetRA1800_8: RA1800.8 ; harness PS_PG.A+12V
NetRA1801_5: RA1801.5 ; harness PS_PG.D+3.3V
NetRA1801_6: RA1801.6 ; harness PS_PG.A+3.3V
NetRA1801_7: RA1801.7 ; harness PS_PG.A+5V
NetRA1801_8: RA1801.8 ; harness PS_PG.A-12V
NetRA1802_6: RA1802.6 ; port GPIO.3
NetRA1802_7: RA1802.7 ; port GPIO.2

Not connected (* = marked no-connect by the designer): X1 180(SD1_CMD)* 184(SD1_CLK)* 190(SD1_CD#)* 305(AN1_ADC0)* 307(AN1_ADC1)* 309(AN1_ADC2)* 311(AN1_TSWIP_ADC3)*

### Notes on the sheet
- (near J1800) Supply Cotrol
- (near J1800) LED+
- (near J1800) LED-
- Note
- This design is a modified version of the Toradex Ixora carrier board.
- Visit
- Compatible Apalis Modules can be bought from the
- Toradex Developer Resouces <https://developer.toradex.com/products/ixora-carrier-board>
- for the original Altium Project.
- Toradex Shop. <https://www.toradex.com/order-now/apalis-arm-family>
- Project:
- Size:
- Sheet:
- Title:
- A3
- of
- Drawn by:
- Revision:
- Date:
- Variant:
- b
- File:
- (in symbol CON-JAE-MM70-314-310B1-314-0.5mm, part E) Apalis - PWM and Analog; 5 of 25
- (in symbol CON-JAE-MM70-314-310B1-314-0.5mm, part F) Apalis - SDIO; 6 of 25
- (in symbol CON-JAE-MM70-314-310B1-314-0.5mm, part P) Apalis - GPIO; 16 of 25
- (in symbol CON-JAE-MM70-314-310B1-314-0.5mm, part U) Apalis - SPI; 21 of 25

### Library data of the parts
C1800 = C-X7R-100nF-16V-10%-0402: Capacitor Ceramic X7R 100nF 16V 10% 0603; Tolerance: 10%; Type: X7R; Value: 100nF
D1800 D1802 = LED green: Manufacturer Part No.: LGM67KG1J224Z
D1801 D1803 = LED red: Manufacturer Part No.: LS M67K-J2L1-1-Z
J1800 = Connector 2x1P: Manufacturer Part No.: B2B-PH-K-S; System: Connector
J1801 = Connector 6x1P: Manufacturer Part No.: B6B-PHK-S; System: Connector
R1800 = Resistor
R1801 R1806 R1807 R1810 R1811 = R-100KR-63mW-5%-0402: as R702 on sheet Power_Switch; Rating: 63mW; Tolerance: 5%
R1802 R1803 = R-0R-63mW-1%-0603: Resistor 0 ohm 63mW 1% 0603; Rating: 63mW; Tolerance: 1%; Value: 0R
R1804 R1805 R1808 R1809 = R-560R-63mW-5%-0402: Resistor 560 ohm 63mW 5% 0603; Rating: 63mW; Tolerance: 5%; Value: 560R
RA1800-RA1804 = RA-22R-63mW-5%-1206-div: Resistor Array 22 R 63mW 5% 1206; Tolerance: 5%; Power Dissipation: 63mW; Value: 22R
T1800-T1802 = T-Vishay-SI-1024X-N: as T702 on sheet Power_Switch
X1 = CON-JAE-MM70-314-310B1-314-0.5mm: as X1 on sheet Power_Switch